# EAGLE design Electronic_Load_V1A (EAGLE 9.1.2)

## Sheet 1 of 5
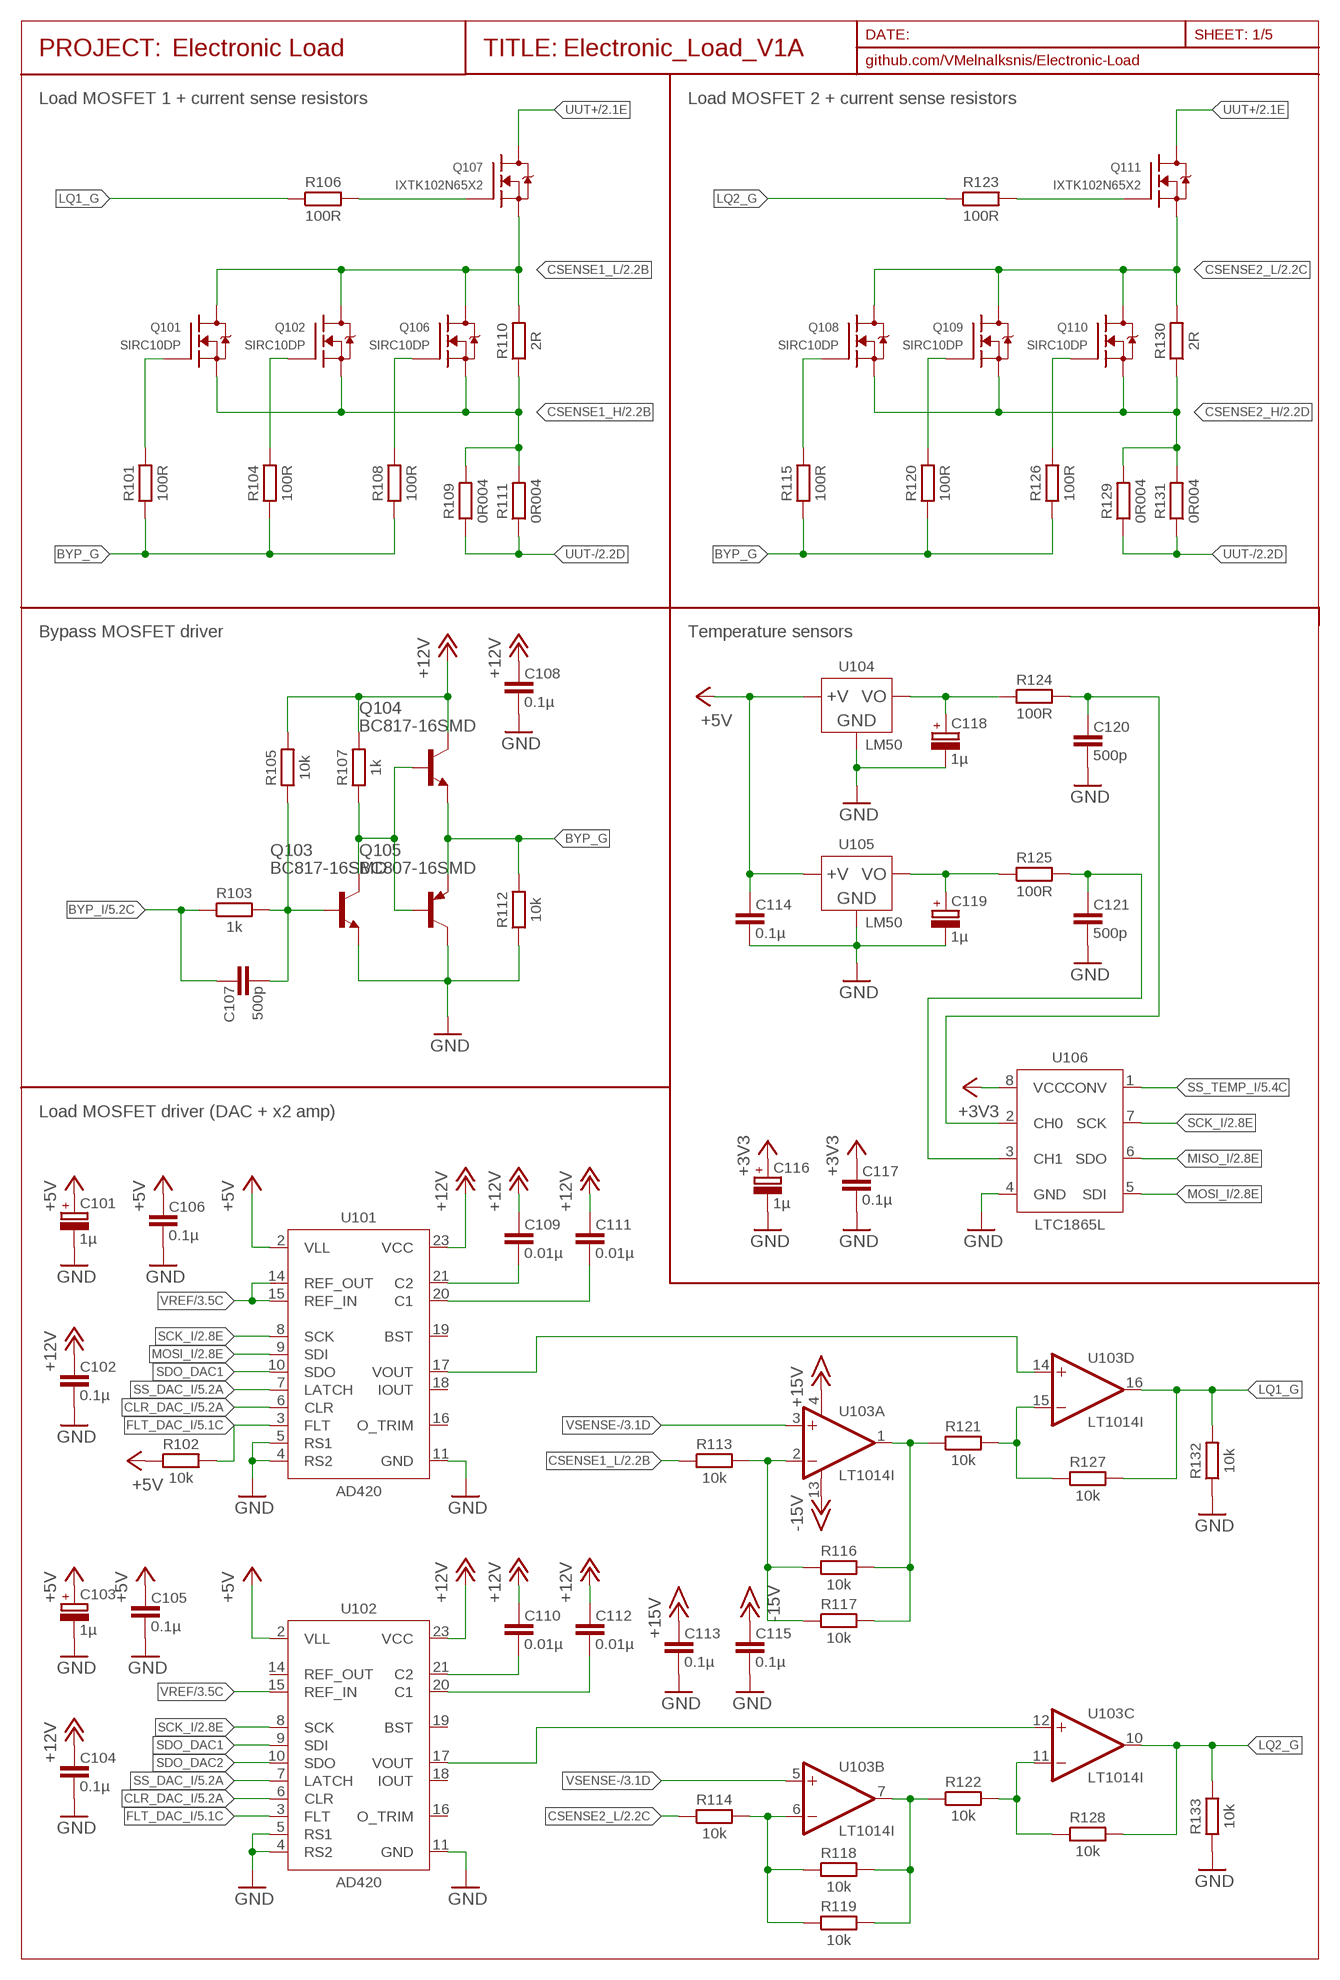
[diagram p0: schematic, sheet 1]
FRAME101 (A4-S35CP): GITHUB: github.com/VMelnalksnis/Electronic-Load; PROJECT_NAME: Electronic Load

### Parts
C101  1µ  CPOL-3216-A  [CT3216]
C102  0.1µ  C-EU-3216  [C3216]
C103  1µ  CPOL-3216-A  [CT3216]
C104  0.1µ  C-EU-3216  [C3216]
C105  0.1µ  C-EU-3216  [C3216]
C106  0.1µ  C-EU-3216  [C3216]
C107  500p  C-EU-1608  [C1608]
C108  0.1µ  C-EU-3216  [C3216]
C109  0.01µ  C-EU-3216  [C3216]
C110  0.01µ  C-EU-3216  [C3216]
C111  0.01µ  C-EU-3216  [C3216]
C112  0.01µ  C-EU-3216  [C3216]
C113  0.1µ  C-EU-3216  [C3216]
C114  0.1µ  C-EU-3216  [C3216]
C115  0.1µ  C-EU-3216  [C3216]
C116  1µ  CPOL-3216-A  [CT3216]
C117  0.1µ  C-EU-3216  [C3216]
C118  1µ  CPOL-3216-A  [CT3216]
C119  1µ  CPOL-3216-A  [CT3216]
C120  500p  C-EU-1608  [C1608]
C121  500p  C-EU-1608  [C1608]
Q101  SIRC10DP  [POWERPAK-SO-8]
Q102  SIRC10DP  [POWERPAK-SO-8]
Q103  BC817-16SMD  [SOT23-BEC]
Q104  BC817-16SMD  [SOT23-BEC]
Q105  BC807-16SMD  [SOT23-BEC]
Q106  SIRC10DP  [POWERPAK-SO-8]
Q107  IXTK102N65X2  IXTK102N65X2-NOPCB  (no package)
Q108  SIRC10DP  [POWERPAK-SO-8]
Q109  SIRC10DP  [POWERPAK-SO-8]
Q110  SIRC10DP  [POWERPAK-SO-8]
Q111  IXTK102N65X2  IXTK102N65X2-NOPCB  (no package)
R101  100R  R-EU-2012  [R2012W]
R102  10k  R-EU-1608  [R1608]
R103  1k  R-EU-1608  [R1608]
R104  100R  R-EU-2012  [R2012W]
R105  10k  R-EU-1608  [R1608]
R106  100R  R-EU-2012  [R2012W]
R107  1k  R-EU-1608  [R1608]
R108  100R  R-EU-2012  [R2012W]
R109  0R004  R-EU-6332  [R6332W]
R110  2R  R-EU-3216  [R3216W]
R111  0R004  R-EU-6332  [R6332W]
R112  10k  R-EU-1608  [R1608]
R113  10k  R-EU-1608  [R1608]
R114  10k  R-EU-1608  [R1608]
R115  100R  R-EU-2012  [R2012W]
R116  10k  R-EU-1608  [R1608]
R117  10k  R-EU-1608  [R1608]
R118  10k  R-EU-1608  [R1608]
R119  10k  R-EU-1608  [R1608]
R120  100R  R-EU-2012  [R2012W]
R121  10k  R-EU-1608  [R1608]
R122  10k  R-EU-1608  [R1608]
R123  100R  R-EU-2012  [R2012W]
R124  100R  R-EU-2012  [R2012W]
R125  100R  R-EU-2012  [R2012W]
R126  100R  R-EU-2012  [R2012W]
R127  10k  R-EU-1608  [R1608]
R128  10k  R-EU-1608  [R1608]
R129  0R004  R-EU-6332  [R6332W]
R130  2R  R-EU-3216  [R3216W]
R131  0R004  R-EU-6332  [R6332W]
R132  10k  R-EU-1608  [R1608]
R133  10k  R-EU-1608  [R1608]
U101  AD420  AD420RW-24  [SO24W]
U102  AD420  AD420RW-24  [SO24W]
U103  LT1014I  LT1014ISW  [SO16W]
U104  LM50  LM50-NOPCB  (no package)
U105  LM50  LM50-NOPCB  (no package)
U106  LTC1865L  [SO8]

### Nets
+3V3: C116.+ C117.1 U106.8(VCC) ; also sheet 2,3
+5V: C101.+ C103.+ C105.1 C106.1 C114.1 R102.1 U101.2(VLL) U102.2(VLL) U104.+V U105.+V ; also sheet 3,5
+12V: C102.1 C104.1 C108.1 C109.1 C110.1 C111.1 C112.1 Q104.C R105.2 R107.2 U101.23(VCC) U102.23(VCC) ; also sheet 3
+15V: C113.1 U103.4(A:V+) ; also sheet 2,3
-15V: C115.1 U103.13(A:V-) ; also sheet 2,3
BYP_G: Q104.E Q105.E R101.1 R104.1 R108.1 R112.2 R115.1 R120.1 R126.1
BYP_I: C107.1 R103.1 ; also sheet 5
CLR_DAC_I: U101.6(CLR) U102.6(CLR) ; also sheet 5
CSENSE1_H: Q101.1(S) Q101.2(S) Q101.3(S) Q102.1(S) Q102.2(S) Q102.3(S) Q106.1(S) Q106.2(S) Q106.3(S) R109.2 R110.1 R111.2 ; also sheet 2
CSENSE1_L: Q101.5(D) Q102.5(D) Q106.5(D) Q107.S R110.2 R113.1 ; also sheet 2,3
CSENSE2_H: Q108.1(S) Q108.2(S) Q108.3(S) Q109.1(S) Q109.2(S) Q109.3(S) Q110.1(S) Q110.2(S) Q110.3(S) R129.2 R130.1 R131.2 ; also sheet 2
CSENSE2_L: Q108.5(D) Q109.5(D) Q110.5(D) Q111.S R114.1 R130.2 ; also sheet 2,3
FLT_DAC_I: R102.2 U101.3(FLT) U102.3(FLT) ; also sheet 5
GATE1: Q107.G R106.2 ; also sheet 3
GATE2: Q111.G R123.2 ; also sheet 3
GND: C101.- C102.2 C103.- C104.2 C105.2 C106.2 C108.2 C113.2 C114.2 C115.2 C116.- C117.2 C118.- C119.- C120.2 C121.2 Q103.E Q105.C R112.1 R132.1 R133.1 U101.4(RS2) U101.5(RS1) U101.11(GND) U102.4(RS2) U102.5(RS1) U102.11(GND) U104.GND U105.GND U106.4(GND) ; also sheet 2,3,4,5
LBQ11_G: Q101.4(G) R101.2
LBQ12_G: Q102.4(G) R104.2
LBQ13_G: Q106.4(G) R108.2
LBQ21_G: Q108.4(G) R115.2
LBQ22_G: Q109.4(G) R120.2
LBQ23_G: Q110.4(G) R126.2
LQ1_G: R106.1 R127.2 R132.2 U103.16(D:OUT)
LQ2_G: R123.1 R128.2 R133.2 U103.10(C:OUT)
MISO_I: U106.6(SDO) ; also sheet 2,5
MOSI_I: U101.9(SDI) U106.5(SDI) ; also sheet 2,5
N$3: C109.2 U101.21(C2)
N$4: C111.2 U101.20(C1)
N$5: Q103.C Q104.B Q105.B R107.1
N$6: C110.2 U102.21(C2)
N$7: C112.2 U102.20(C1)
N$8: C107.2 Q103.B R103.2 R105.1
N$9: R122.2 R128.1 U103.11(C:-IN)
N$10: U101.17(VOUT) U103.14(D:+IN)
N$11: U102.17(VOUT) U103.12(C:+IN)
N$12: R121.2 R127.1 U103.15(D:-IN)
N$13: R116.2 R117.2 R121.1 U103.1(A:OUT)
N$14: R113.2 R116.1 R117.1 U103.2(A:-IN)
N$15: R114.2 R118.1 R119.1 U103.6(B:-IN)
N$16: R118.2 R119.2 R122.1 U103.7(B:OUT)
SCK_I: U101.8(SCK) U102.8(SCK) U106.7(SCK) ; also sheet 2,5
SDO_DAC1: U101.10(SDO) U102.9(SDI)
SDO_DAC2: U102.10(SDO)
SS_DAC_I: U101.7(LATCH) U102.7(LATCH) ; also sheet 5
SS_TEMP_I: U106.1(CONV) ; also sheet 5
T1_OUT: C118.+ R124.1 U104.VO ; also sheet 3
T2_OUT: C119.+ R125.1 U105.VO ; also sheet 3
TEMP1: C120.1 R124.2 U106.2(CH0)
TEMP2: C121.1 R125.2 U106.3(CH1)
UUT+ [500V]: Q107.D Q111.D ; also sheet 2
UUT-: R109.1 R111.1 R129.1 R131.1 ; also sheet 2,3
VREF: U101.14(REF_OUT) U101.15(REF_IN) U102.15(REF_IN) ; also sheet 3
VSENSE-: U103.3(A:+IN) U103.5(B:+IN) ; also sheet 2,3
Unconnected: U101.16(O_TRIM) U101.18(IOUT) U101.19(BST) U102.14(REF_OUT) U102.16(O_TRIM) U102.18(IOUT) U102.19(BST)

### Notes on the sheet
- Load MOSFET 1 + current sense resistors | Load MOSFET 2 + current sense resistors
- Bypass MOSFET driver | Temperature sensors
- Load MOSFET driver (DAC + x2 amp)

## Sheet 2 of 5
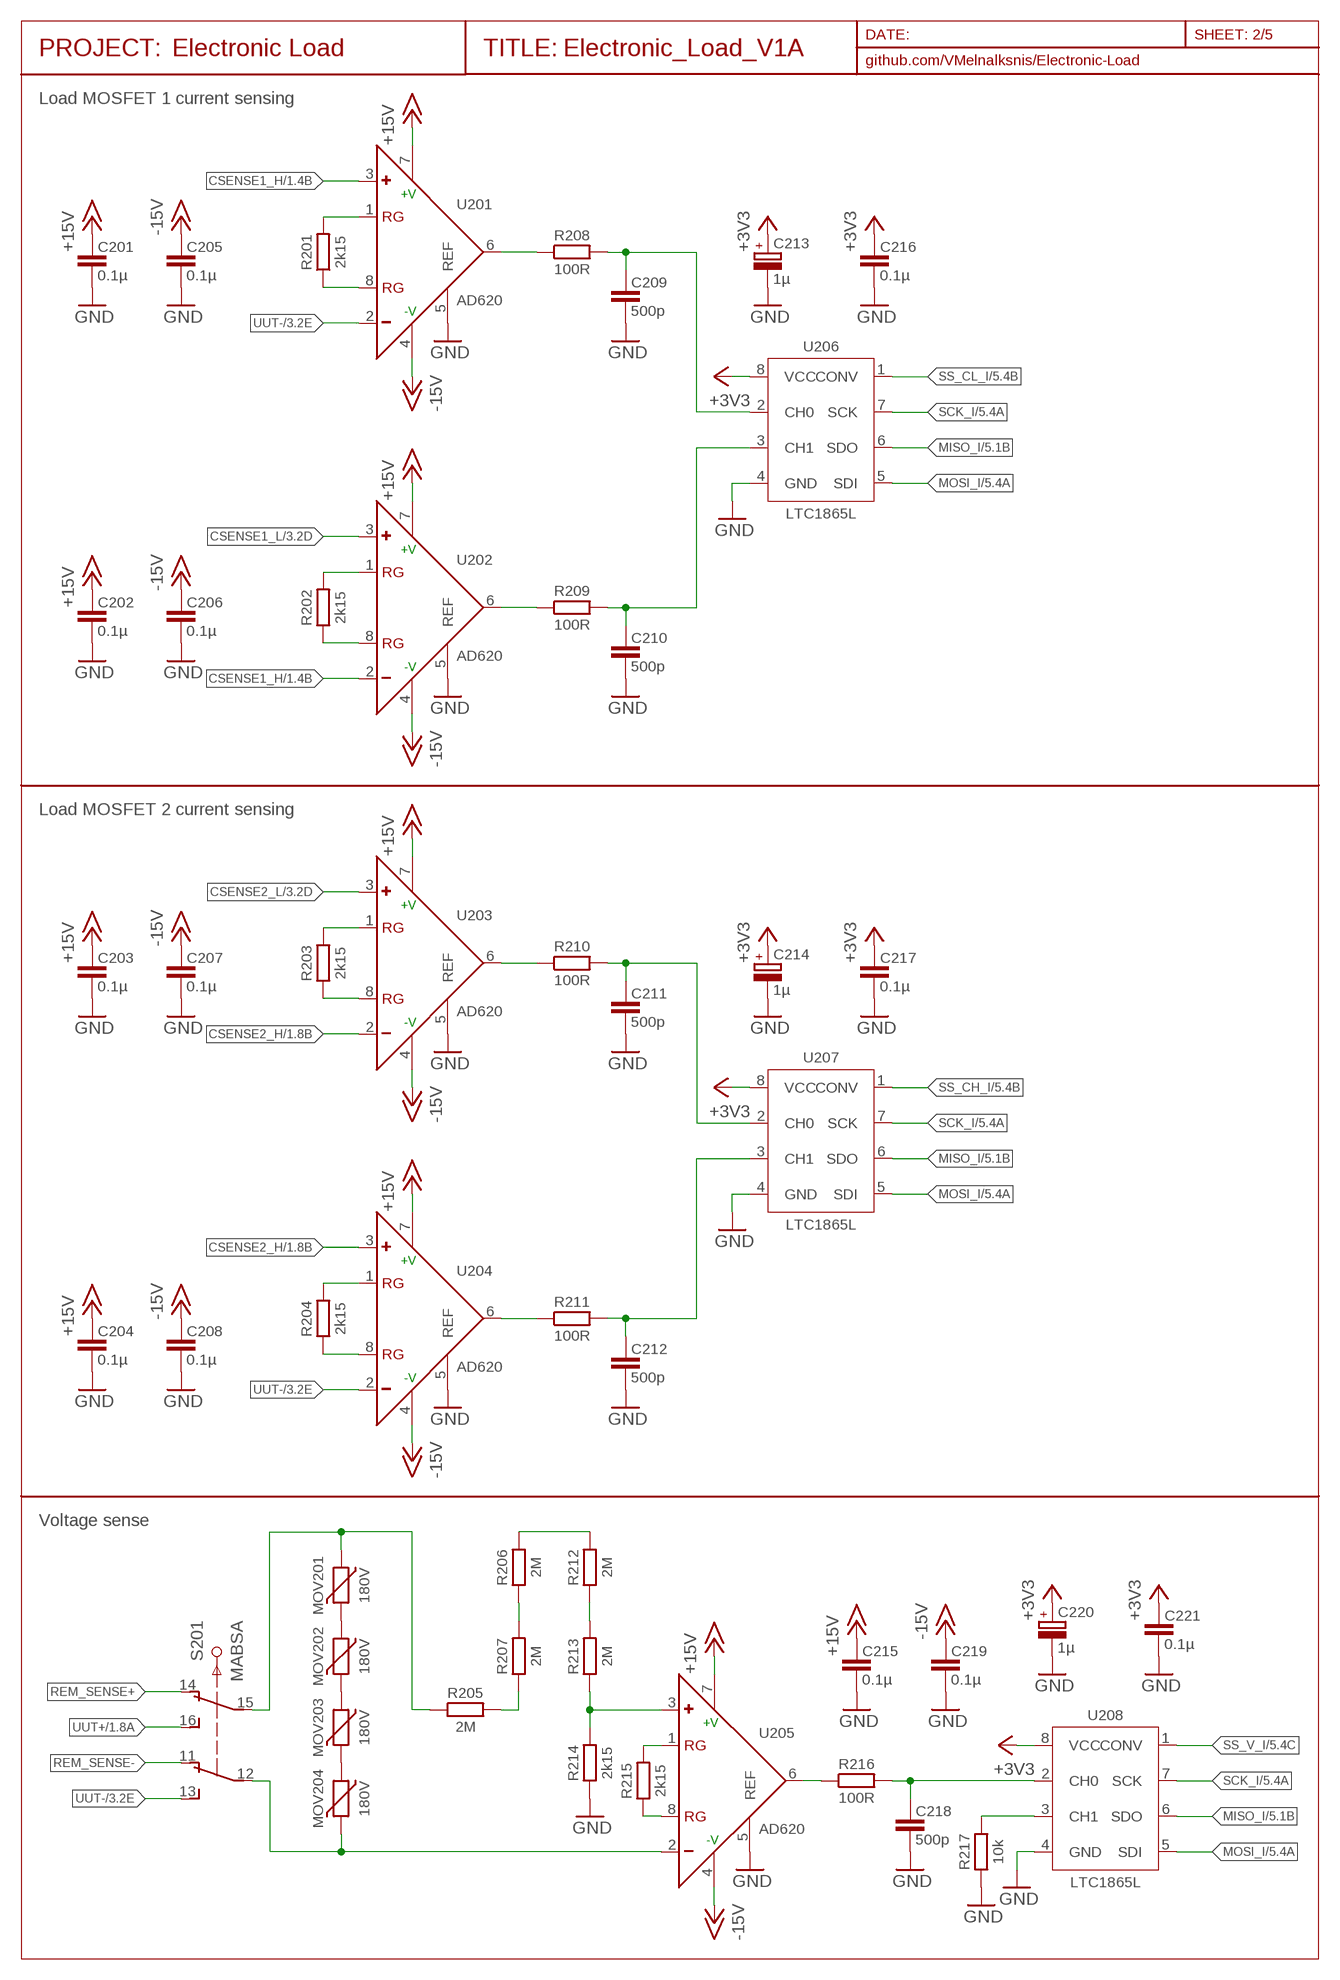
[diagram p1: schematic, sheet 2]
FRAME201 (A4-S35CP): GITHUB: github.com/VMelnalksnis/Electronic-Load; PROJECT_NAME: Electronic Load

### Parts
C201  0.1µ  C-EU-3216  [C3216]
C202  0.1µ  C-EU-3216  [C3216]
C203  0.1µ  C-EU-3216  [C3216]
C204  0.1µ  C-EU-3216  [C3216]
C205  0.1µ  C-EU-3216  [C3216]
C206  0.1µ  C-EU-3216  [C3216]
C207  0.1µ  C-EU-3216  [C3216]
C208  0.1µ  C-EU-3216  [C3216]
C209  500p  C-EU-1608  [C1608]
C210  500p  C-EU-1608  [C1608]
C211  500p  C-EU-1608  [C1608]
C212  500p  C-EU-1608  [C1608]
C213  1µ  CPOL-3216-A  [CT3216]
C214  1µ  CPOL-3216-A  [CT3216]
C215  0.1µ  C-EU-3216  [C3216]
C216  0.1µ  C-EU-3216  [C3216]
C217  0.1µ  C-EU-3216  [C3216]
C218  500p  C-EU-1608  [C1608]
C219  0.1µ  C-EU-3216  [C3216]
C220  1µ  CPOL-3216-A  [CT3216]
C221  0.1µ  C-EU-3216  [C3216]
MOV201  180V  MOV-3225  [R3225W]
MOV202  180V  MOV-3225  [R3225W]
MOV203  180V  MOV-3225  [R3225W]
MOV204  180V  MOV-3225  [R3225W]
R201  2k15  R-EU-2012  [R2012W]
R202  2k15  R-EU-2012  [R2012W]
R203  2k15  R-EU-2012  [R2012W]
R204  2k15  R-EU-2012  [R2012W]
R205  2M  R-EU-3216  [R3216W]
R206  2M  R-EU-3216  [R3216W]
R207  2M  R-EU-3216  [R3216W]
R208  100R  R-EU-2012  [R2012W]
R209  100R  R-EU-2012  [R2012W]
R210  100R  R-EU-2012  [R2012W]
R211  100R  R-EU-2012  [R2012W]
R212  2M  R-EU-3216  [R3216W]
R213  2M  R-EU-3216  [R3216W]
R214  2k15  R-EU-2012  [R2012W]
R215  2k15  R-EU-2012  [R2012W]
R216  100R  R-EU-2012  [R2012W]
R217  10k  R-EU-1608  [R1608]
S201  MABSA  [MABSA]
U201  AD620  AD620R-8  [SO8]
U202  AD620  AD620R-8  [SO8]
U203  AD620  AD620R-8  [SO8]
U204  AD620  AD620R-8  [SO8]
U205  AD620  AD620R-8  [SO8]
U206  LTC1865L  [SO8]
U207  LTC1865L  [SO8]
U208  LTC1865L  [SO8]

### Nets
+3V3: C213.+ C214.+ C216.1 C217.1 C220.+ C221.1 U206.8(VCC) U207.8(VCC) U208.8(VCC) ; also sheet 1,3
+15V: C201.1 C202.1 C203.1 C204.1 C215.1 U201.7(+V) U202.7(+V) U203.7(+V) U204.7(+V) U205.7(+V) ; also sheet 1,3
-15V: C205.1 C206.1 C207.1 C208.1 C219.1 U201.4(-V) U202.4(-V) U203.4(-V) U204.4(-V) U205.4(-V) ; also sheet 1,3
CSENSE1_H: U201.3(+) U202.2(-) ; also sheet 1
CSENSE1_L: U202.3(+) ; also sheet 1,3
CSENSE2_H: U203.2(-) U204.3(+) ; also sheet 1
CSENSE2_L: U203.3(+) ; also sheet 1,3
GND: C201.2 C202.2 C203.2 C204.2 C205.2 C206.2 C207.2 C208.2 C209.2 C210.2 C211.2 C212.2 C213.- C214.- C215.2 C216.2 C217.2 C218.2 C219.2 C220.- C221.2 R214.1 R217.1 U201.5(REF) U202.5(REF) U203.5(REF) U204.5(REF) U205.5(REF) U206.4(GND) U207.4(GND) U208.4(GND) ; also sheet 1,3,4,5
MISO_I: U206.6(SDO) U207.6(SDO) U208.6(SDO) ; also sheet 1,5
MOSI_I: U206.5(SDI) U207.5(SDI) U208.5(SDI) ; also sheet 1,5
N$1: MOV201.2 MOV202.1
N$2: MOV202.2 MOV203.1
N$17: R210.1 U203.6(OUT)
N$18: C211.1 R210.2 U207.2(CH0)
N$19: R211.1 U204.6(OUT)
N$20: C212.1 R211.2 U207.3(CH1)
N$21: C209.1 R208.2 U206.2(CH0)
N$22: C210.1 R209.2 U206.3(CH1)
N$23: R209.1 U202.6(OUT)
N$24: R208.1 U201.6(OUT)
N$25: R212.1 R213.2
N$26: R206.2 R212.2
N$27: R206.1 R207.2
N$28: R205.2 R207.1
N$29: R213.1 R214.2 U205.3(+)
N$30: C218.1 R216.2 U208.2(CH0)
N$31: R216.1 U205.6(OUT)
N$36: MOV203.2 MOV204.1
N$45: R217.2 U208.3(CH1)
REM_SENSE+: S201.14
REM_SENSE-: S201.11
RG1_H4: R203.2 U203.1(RG)
RG1_H5: R204.2 U204.1(RG)
RG1_H6: R215.2 U205.1(RG)
RG1_L3: R201.2 U201.1(RG)
RG1_L4: R202.2 U202.1(RG)
RG2_H4: R203.1 U203.8(RG)
RG2_H5: R204.1 U204.8(RG)
RG2_H6: R215.1 U205.8(RG)
RG2_L3: R201.1 U201.8(RG)
RG2_L4: R202.1 U202.8(RG)
SCK_I: U206.7(SCK) U207.7(SCK) U208.7(SCK) ; also sheet 1,5
SS_CH_I: U207.1(CONV) ; also sheet 5
SS_CL_I: U206.1(CONV) ; also sheet 5
SS_V_I: U208.1(CONV) ; also sheet 5
UUT+ [500V]: S201.16 ; also sheet 1
UUT-: S201.13 U201.2(-) U204.2(-) ; also sheet 1,3
VSENSE+: MOV201.1 R205.1 S201.15 ; also sheet 3
VSENSE-: MOV204.2 S201.12 U205.2(-) ; also sheet 1,3

### Notes on the sheet
- Load MOSFET 1 current sensing
- Load MOSFET 2 current sensing
- Voltage sense

## Sheet 3 of 5
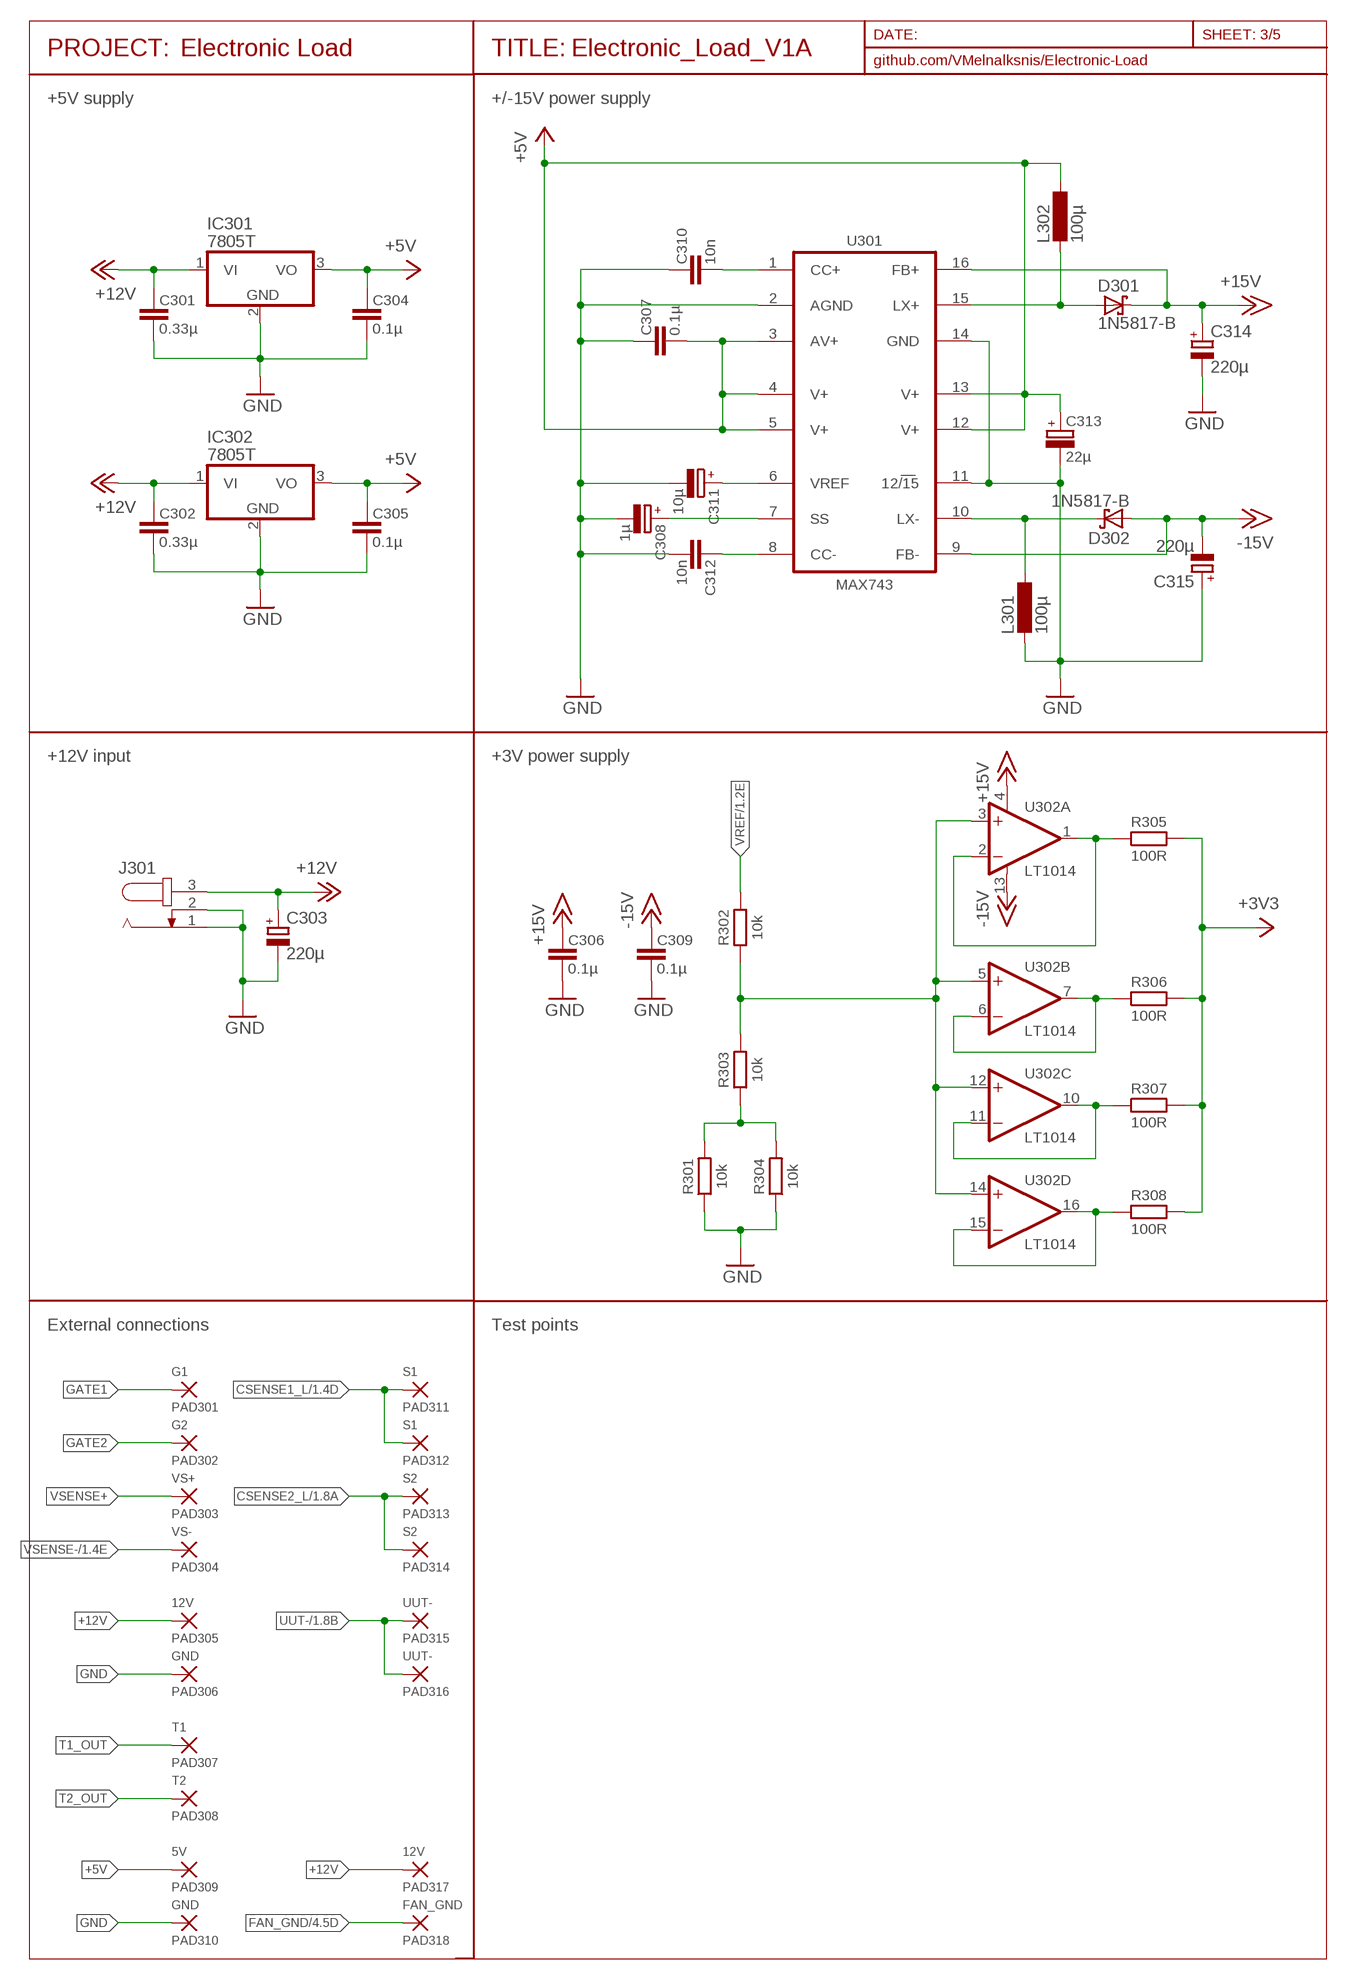
[diagram p2: schematic, sheet 3]
FRAME301 (A4-S35CP): GITHUB: github.com/VMelnalksnis/Electronic-Load; PROJECT_NAME: Electronic Load

### Parts
C301  0.33µ  C-EU-3216  [C3216]
C302  0.33µ  C-EU-3216  [C3216]
C303  220µ  CPOL-EUE3.5-10  [E3,5-10]
C304  0.1µ  C-EU-3216  [C3216]
C305  0.1µ  C-EU-3216  [C3216]
C306  0.1µ  C-EU-3216  [C3216]
C307  0.1µ  C-EU-3216  [C3216]
C308  1µ  CPOL-3216-A  [CT3216]
C309  0.1µ  C-EU-3216  [C3216]
C310  10n  C-EU-3216  [C3216]
C311  10µ  CPOL-6032-C  [CT6032]
C312  10n  C-EU-3216  [C3216]
C313  22µ  CPOL-6032-C  [CT6032]
C314  220µ  CPOL-EUE3.5-10  [E3,5-10]
C315  220µ  CPOL-EUE3.5-10  [E3,5-10]
D301  1N5817-B  [DO41-7.6]
D302  1N5817-B  [DO41-7.6]
IC301  7805T  [TO220H]
IC302  7805T  [TO220H]
J301  JACK-PLUG0  [SPC4077]
L301  100µ  L-EU0204/5  [0204/5]
L302  100µ  L-EU0204/5  [0204/5]
PAD301  G1  PAD-5X2  [PAD-5X2]
PAD302  G2  PAD-5X2  [PAD-5X2]
PAD303  VS+  PAD-5X2  [PAD-5X2]
PAD304  VS-  PAD-5X2  [PAD-5X2]
PAD305  12V  PAD-5X2  [PAD-5X2]
PAD306  GND  PAD-5X2  [PAD-5X2]
PAD307  T1  PAD-5X2  [PAD-5X2]
PAD308  T2  PAD-5X2  [PAD-5X2]
PAD309  5V  PAD-5X2  [PAD-5X2]
PAD310  GND  PAD-5X2  [PAD-5X2]
PAD311  S1  PAD-10X4  [PAD-10X4]
PAD312  S1  PAD-10X4  [PAD-10X4]
PAD313  S2  PAD-10X4  [PAD-10X4]
PAD314  S2  PAD-10X4  [PAD-10X4]
PAD315  UUT-  PAD-10X4  [PAD-10X4]
PAD316  UUT-  PAD-10X4  [PAD-10X4]
PAD317  12V  PAD-5X2  [PAD-5X2]
PAD318  FAN_GND  PAD-5X2  [PAD-5X2]
R301  10k  R-EU-1608  [R1608]
R302  10k  R-EU-1608  [R1608]
R303  10k  R-EU-1608  [R1608]
R304  10k  R-EU-1608  [R1608]
R305  100R  R-EU-2012  [R2012W]
R306  100R  R-EU-2012  [R2012W]
R307  100R  R-EU-2012  [R2012W]
R308  100R  R-EU-2012  [R2012W]
U301  MAX743  MAX743WE  [SO16W]
U302  LT1014  LT1014ISW  [SO16W]

### Nets
+3V3: R305.2 R306.2 R307.2 R308.2 ; also sheet 1,2
+5V: C304.1 C305.1 C307.2 C313.+ IC301.3(VO) IC302.3(VO) L302.1 PAD309.1(P) U301.3(AV+) U301.4(V+) U301.5(V+) U301.12(V+) U301.13(V+) ; also sheet 1,5
+12V: C301.1 C302.1 C303.+ IC301.1(VI) IC302.1(VI) J301.3 PAD305.1(P) PAD317.1(P) ; also sheet 1
+15V: C306.1 C314.+ D301.C U301.16(FB+) U302.4(A:V+) ; also sheet 1,2
-15V: C309.1 C315.- D302.A U301.9(FB-) U302.13(A:V-) ; also sheet 1,2
CSENSE1_L: PAD311.1(P) PAD312.1(P) ; also sheet 1,2
CSENSE2_L: PAD313.1(P) PAD314.1(P) ; also sheet 1,2
FAN_GND: PAD318.1(P) ; also sheet 4
GATE1: PAD301.1(P) ; also sheet 1
GATE2: PAD302.1(P) ; also sheet 1
GND: C301.2 C302.2 C303.- C304.2 C305.2 C306.2 C307.1 C308.- C309.2 C310.1 C311.- C312.2 C313.- C314.- C315.+ IC301.2(GND) IC302.2(GND) J301.1 J301.2 L301.2 PAD306.1(P) PAD310.1(P) R301.1 R304.1 U301.2(AGND) U301.11(12/15) U301.14(GND) ; also sheet 1,2,4,5
N$32: C312.1 U301.8(CC-)
N$33: C308.+ U301.7(SS)
N$34: C310.2 U301.1(CC+)
N$35: D301.A L302.2 U301.15(LX+)
N$37: R302.1 R303.2 U302.3(A:+IN) U302.5(B:+IN) U302.12(C:+IN) U302.14(D:+IN)
N$38: R306.1 U302.6(B:-IN) U302.7(B:OUT)
N$39: R305.1 U302.1(A:OUT) U302.2(A:-IN)
N$40: R307.1 U302.10(C:OUT) U302.11(C:-IN)
N$41: D302.C L301.1 U301.10(LX-)
N$43: R308.1 U302.15(D:-IN) U302.16(D:OUT)
N$79: R301.2 R303.1 R304.2
T1_OUT: PAD307.1(P) ; also sheet 1
T2_OUT: PAD308.1(P) ; also sheet 1
UUT-: PAD315.1(P) PAD316.1(P) ; also sheet 1,2
VREF: R302.2 ; also sheet 1
VREF2: C311.+ U301.6(VREF)
VSENSE+: PAD303.1(P) ; also sheet 2
VSENSE-: PAD304.1(P) ; also sheet 1,2

### Notes on the sheet
- +5V supply | +/-15V power supply
- +12V input | +3V power supply
- External connections | Test points

## Sheet 4 of 5
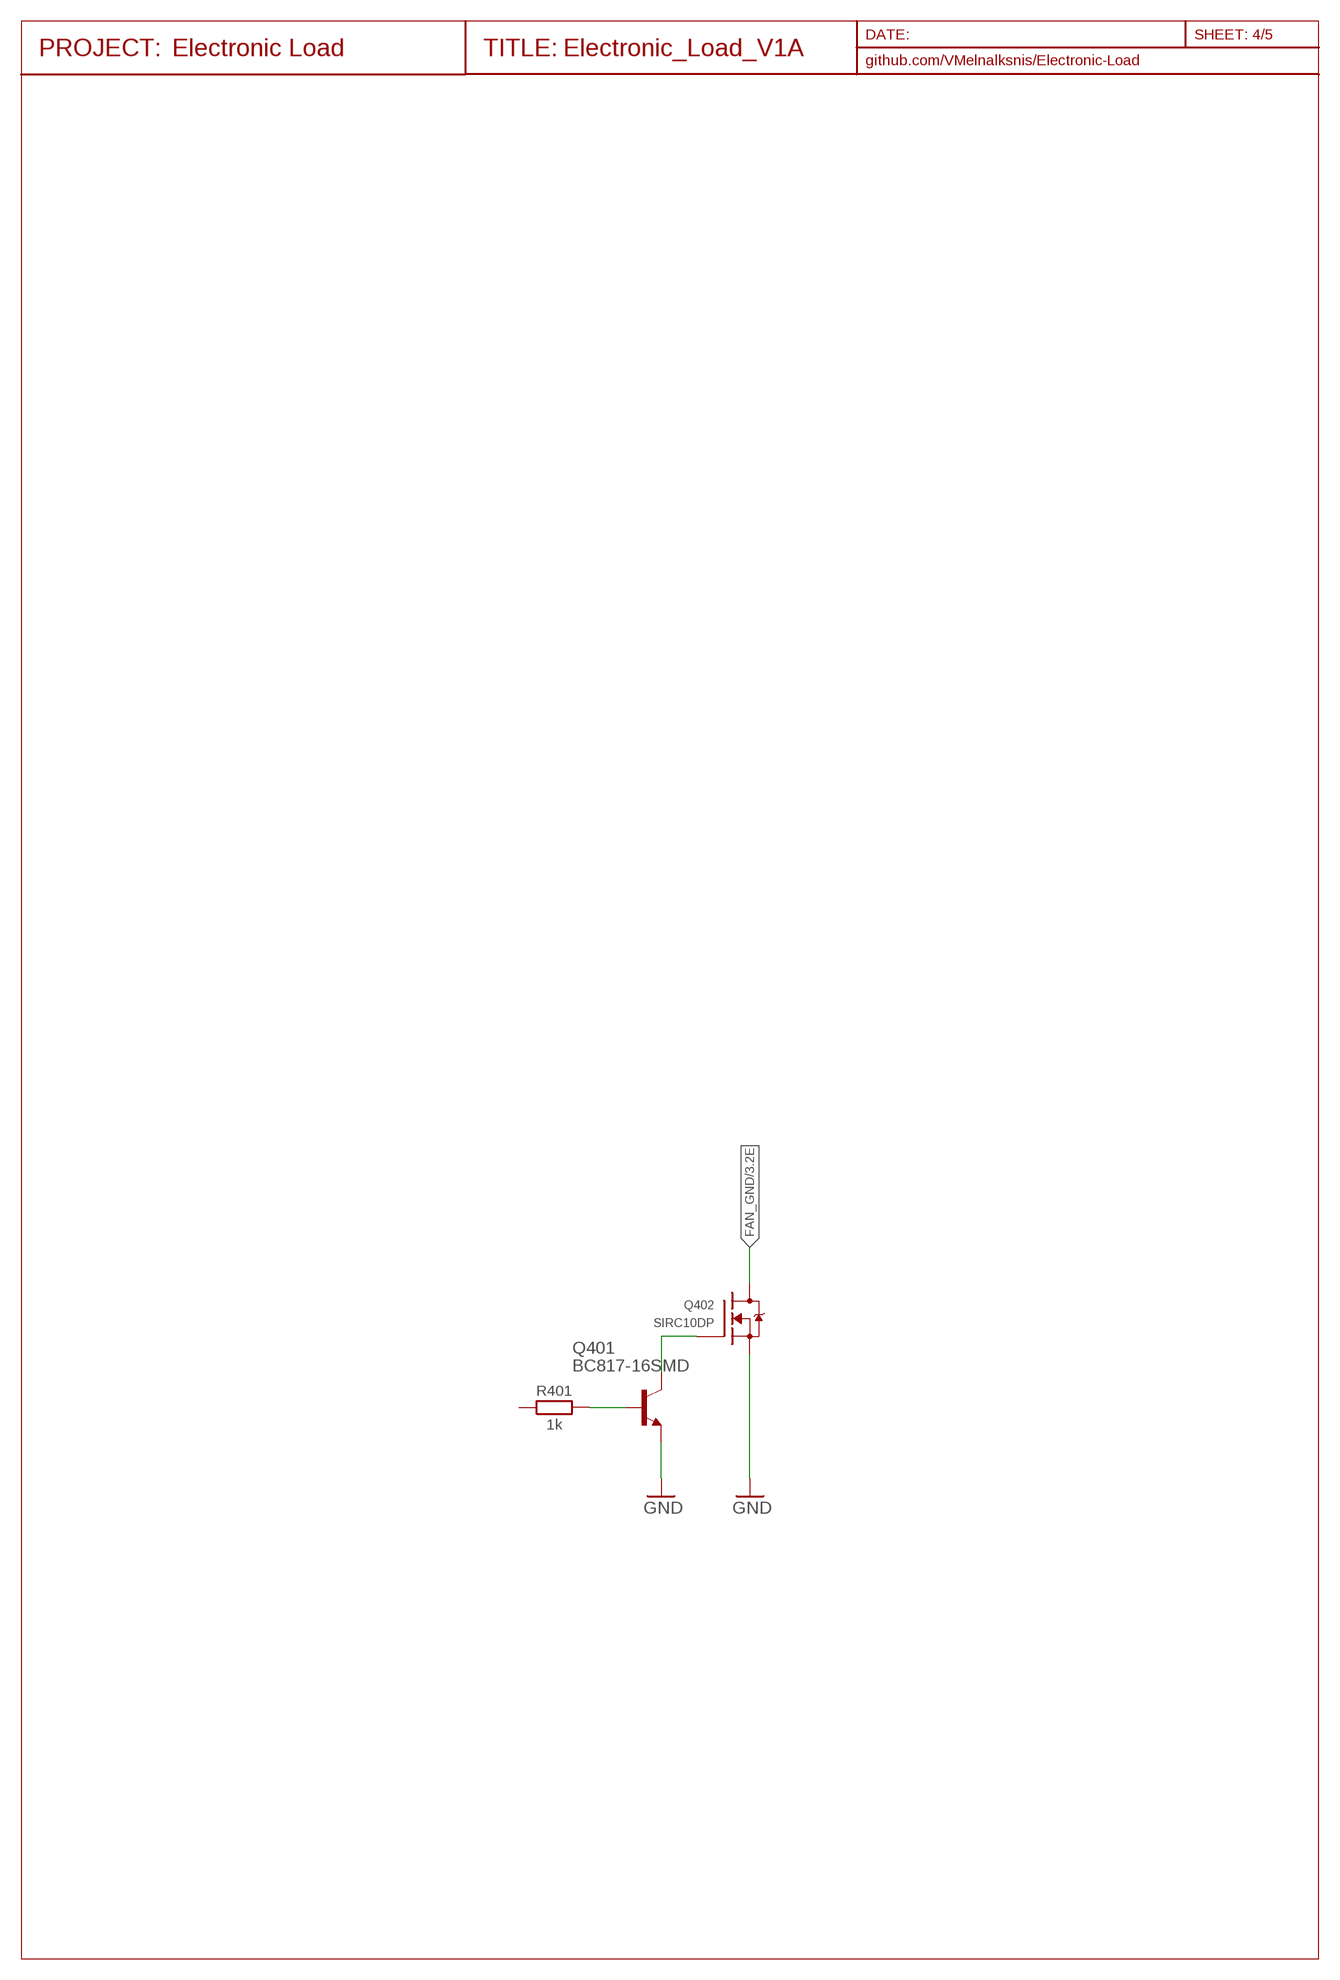
[diagram p3: schematic, sheet 4]
FRAME401 (A4-S35CP): GITHUB: github.com/VMelnalksnis/Electronic-Load; PROJECT_NAME: Electronic Load

### Parts
Q401  BC817-16SMD  [SOT23-BEC]
Q402  SIRC10DP  [POWERPAK-SO-8]
R401  1k  R-EU-1608  [R1608]

### Nets
FAN_GND: Q402.5(D) ; also sheet 3
GND: Q401.E Q402.1(S) Q402.2(S) Q402.3(S) ; also sheet 1,2,3,5
N$42: Q401.C Q402.4(G)
N$44: Q401.B R401.2
Unconnected: R401.1

## Sheet 5 of 5
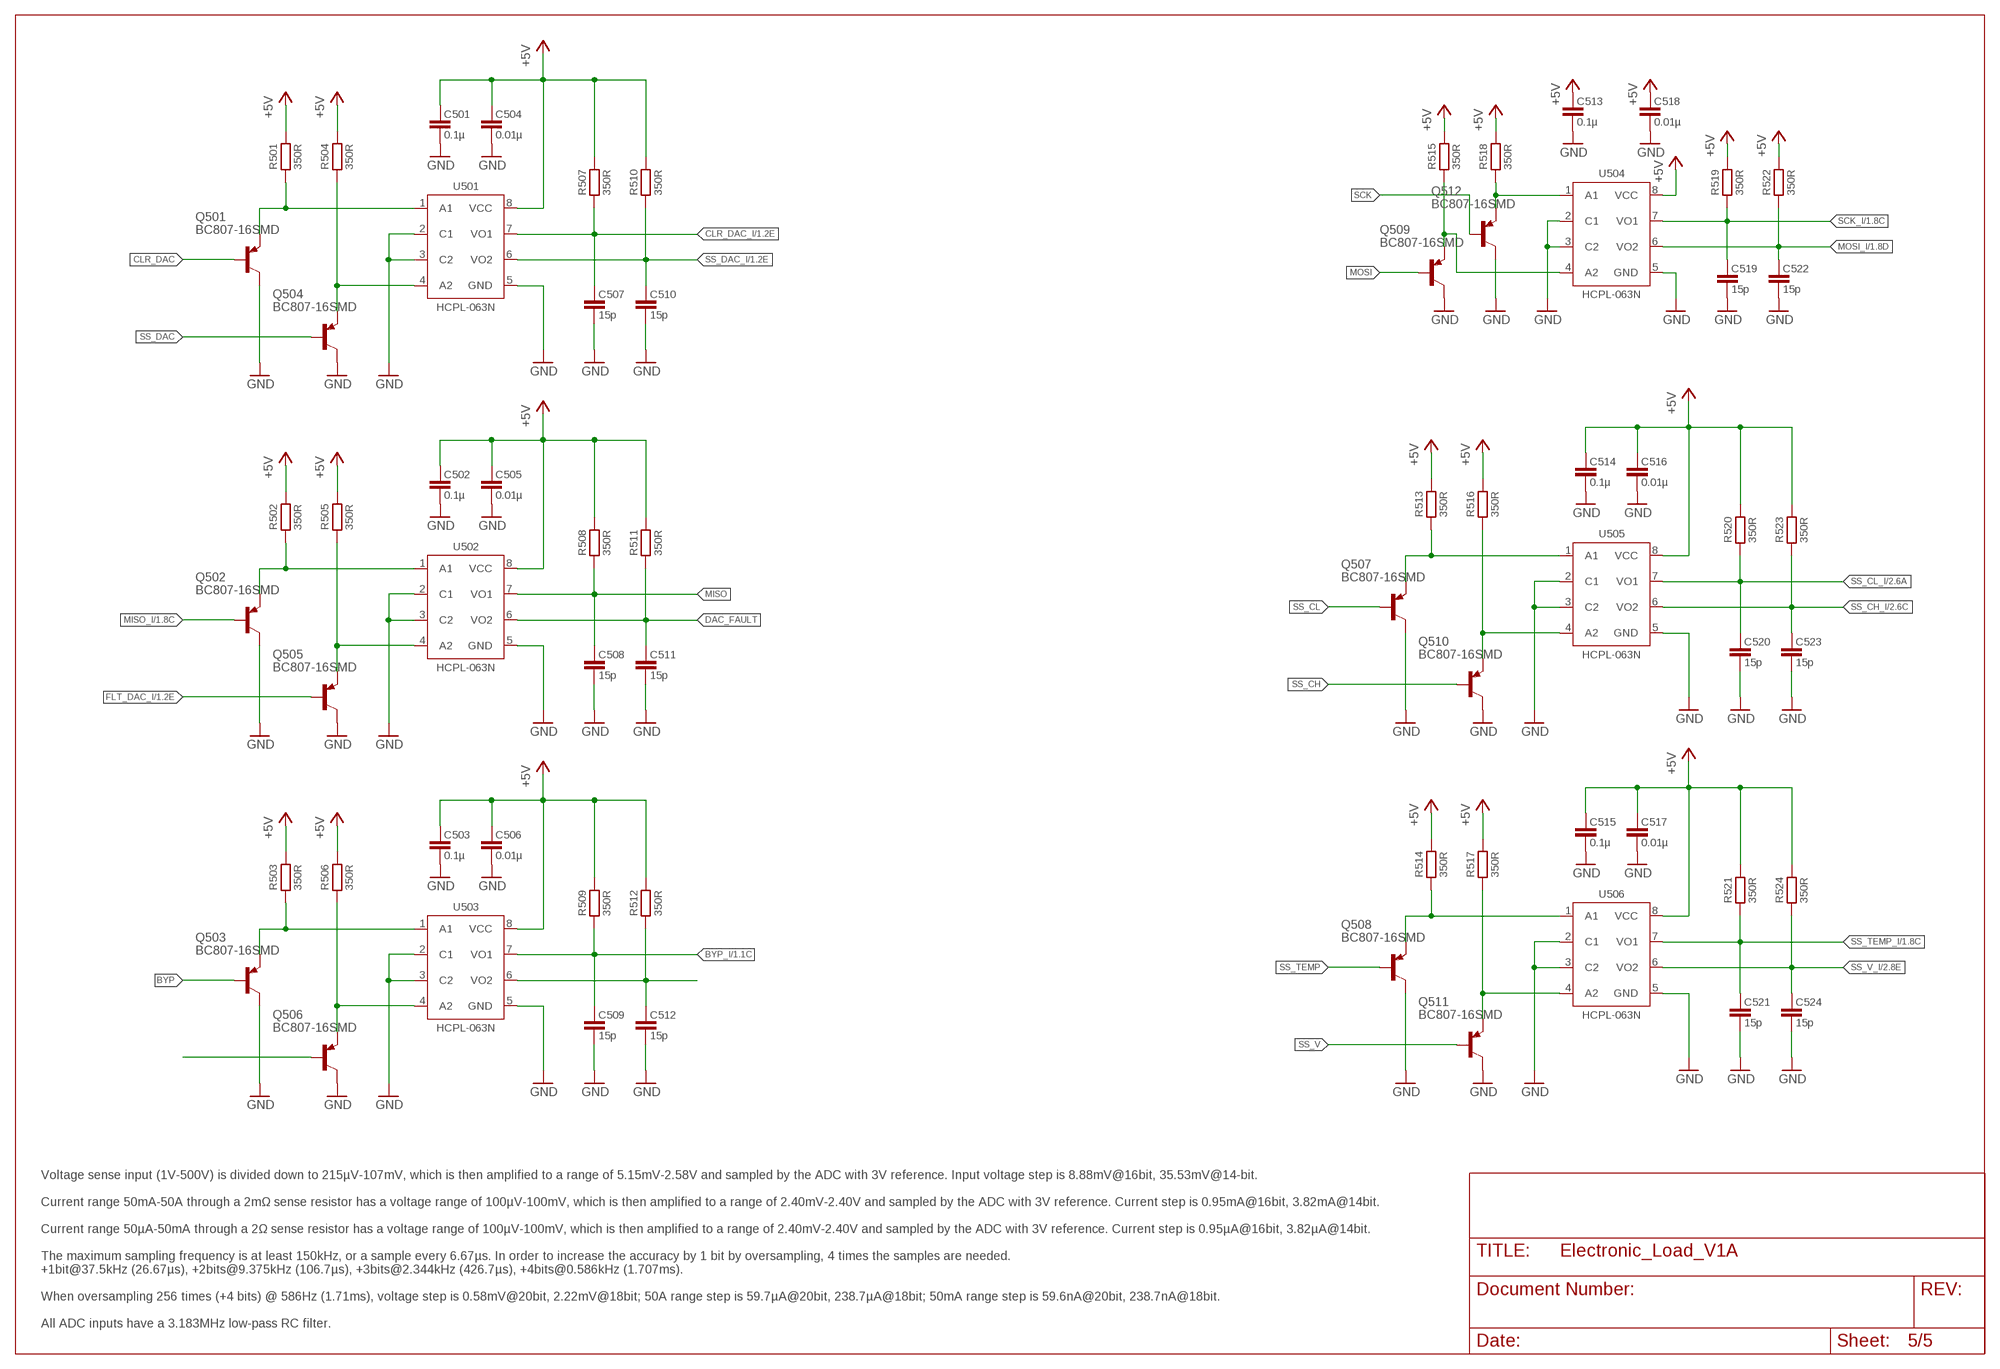
[diagram p4: schematic, sheet 5]

### Parts
C501  0.1µ  C-EU-3216  [C3216]
C502  0.1µ  C-EU-3216  [C3216]
C503  0.1µ  C-EU-3216  [C3216]
C504  0.01µ  C-EU-3216  [C3216]
C505  0.01µ  C-EU-3216  [C3216]
C506  0.01µ  C-EU-3216  [C3216]
C507  15p  C-EU-1608  [C1608]
C508  15p  C-EU-1608  [C1608]
C509  15p  C-EU-1608  [C1608]
C510  15p  C-EU-1608  [C1608]
C511  15p  C-EU-1608  [C1608]
C512  15p  C-EU-1608  [C1608]
C513  0.1µ  C-EU-3216  [C3216]
C514  0.1µ  C-EU-3216  [C3216]
C515  0.1µ  C-EU-3216  [C3216]
C516  0.01µ  C-EU-3216  [C3216]
C517  0.01µ  C-EU-3216  [C3216]
C518  0.01µ  C-EU-3216  [C3216]
C519  15p  C-EU-1608  [C1608]
C520  15p  C-EU-1608  [C1608]
C521  15p  C-EU-1608  [C1608]
C522  15p  C-EU-1608  [C1608]
C523  15p  C-EU-1608  [C1608]
C524  15p  C-EU-1608  [C1608]
Q501  BC807-16SMD  [SOT23-BEC]
Q502  BC807-16SMD  [SOT23-BEC]
Q503  BC807-16SMD  [SOT23-BEC]
Q504  BC807-16SMD  [SOT23-BEC]
Q505  BC807-16SMD  [SOT23-BEC]
Q506  BC807-16SMD  [SOT23-BEC]
Q507  BC807-16SMD  [SOT23-BEC]
Q508  BC807-16SMD  [SOT23-BEC]
Q509  BC807-16SMD  [SOT23-BEC]
Q510  BC807-16SMD  [SOT23-BEC]
Q511  BC807-16SMD  [SOT23-BEC]
Q512  BC807-16SMD  [SOT23-BEC]
R501  350R  R-EU-1608  [R1608]
R502  350R  R-EU-1608  [R1608]
R503  350R  R-EU-1608  [R1608]
R504  350R  R-EU-1608  [R1608]
R505  350R  R-EU-1608  [R1608]
R506  350R  R-EU-1608  [R1608]
R507  350R  R-EU-1608  [R1608]
R508  350R  R-EU-1608  [R1608]
R509  350R  R-EU-1608  [R1608]
R510  350R  R-EU-1608  [R1608]
R511  350R  R-EU-1608  [R1608]
R512  350R  R-EU-1608  [R1608]
R513  350R  R-EU-1608  [R1608]
R514  350R  R-EU-1608  [R1608]
R515  350R  R-EU-1608  [R1608]
R516  350R  R-EU-1608  [R1608]
R517  350R  R-EU-1608  [R1608]
R518  350R  R-EU-1608  [R1608]
R519  350R  R-EU-1608  [R1608]
R520  350R  R-EU-1608  [R1608]
R521  350R  R-EU-1608  [R1608]
R522  350R  R-EU-1608  [R1608]
R523  350R  R-EU-1608  [R1608]
R524  350R  R-EU-1608  [R1608]
U501  HCPL-063N  [SO8]
U502  HCPL-063N  [SO8]
U503  HCPL-063N  [SO8]
U504  HCPL-063N  [SO8]
U505  HCPL-063N  [SO8]
U506  HCPL-063N  [SO8]

### Nets
+5V: C501.1 C502.1 C503.1 C504.1 C505.1 C506.1 C513.1 C514.1 C515.1 C516.1 C517.1 C518.1 R501.2 R502.2 R503.2 R504.2 R505.2 R506.2 R507.2 R508.2 R509.2 R510.2 R511.2 R512.2 R513.2 R514.2 R515.2 R516.2 R517.2 R518.2 R519.2 R520.2 R521.2 R522.2 R523.2 R524.2 U501.8(VCC) U502.8(VCC) U503.8(VCC) U504.8(VCC) U505.8(VCC) U506.8(VCC) ; also sheet 1,3
BYP: Q503.B
BYP_I: C509.1 R509.1 U503.7(VO1) ; also sheet 1
CLR_DAC: Q501.B
CLR_DAC_I: C507.1 R507.1 U501.7(VO1) ; also sheet 1
DAC_FAULT: C511.1 R511.1 U502.6(VO2)
FLT_DAC_I: Q505.B ; also sheet 1
GND: C501.2 C502.2 C503.2 C504.2 C505.2 C506.2 C507.2 C508.2 C509.2 C510.2 C511.2 C512.2 C513.2 C514.2 C515.2 C516.2 C517.2 C518.2 C519.2 C520.2 C521.2 C522.2 C523.2 C524.2 Q501.C Q502.C Q503.C Q504.C Q505.C Q506.C Q507.C Q508.C Q509.C Q510.C Q511.C Q512.C U501.2(C1) U501.3(C2) U501.5(GND) U502.2(C1) U502.3(C2) U502.5(GND) U503.2(C1) U503.3(C2) U503.5(GND) U504.2(C1) U504.3(C2) U504.5(GND) U505.2(C1) U505.3(C2) U505.5(GND) U506.2(C1) U506.3(C2) U506.5(GND) ; also sheet 1,2,3,4
MISO: C508.1 R508.1 U502.7(VO1)
MISO_I: Q502.B ; also sheet 1,2
MOSI: Q509.B
MOSI_I: C522.1 R522.1 U504.6(VO2) ; also sheet 1,2
N$47: Q512.E R518.1 U504.1(A1)
N$49: Q507.E R513.1 U505.1(A1)
N$62: Q509.E R515.1 U504.4(A2)
N$63: Q510.E R516.1 U505.4(A2)
N$64: Q508.E R514.1 U506.1(A1)
N$65: Q511.E R517.1 U506.4(A2)
N$66: Q502.E R502.1 U502.1(A1)
N$67: Q505.E R505.1 U502.4(A2)
N$68: Q503.E R503.1 U503.1(A1)
N$69: Q506.E R506.1 U503.4(A2)
N$71: Q506.B
N$73: C512.1 R512.1 U503.6(VO2)
N$76: Q501.E R501.1 U501.1(A1)
N$77: Q504.E R504.1 U501.4(A2)
SCK: Q512.B
SCK_I: C519.1 R519.1 U504.7(VO1) ; also sheet 1,2
SS_CH: Q510.B
SS_CH_I: C523.1 R523.1 U505.6(VO2) ; also sheet 2
SS_CL: Q507.B
SS_CL_I: C520.1 R520.1 U505.7(VO1) ; also sheet 2
SS_DAC: Q504.B
SS_DAC_I: C510.1 R510.1 U501.6(VO2) ; also sheet 1
SS_TEMP: Q508.B
SS_TEMP_I: C521.1 R521.1 U506.7(VO1) ; also sheet 1
SS_V: Q511.B
SS_V_I: C524.1 R524.1 U506.6(VO2) ; also sheet 2

### Notes on the sheet
- Voltage sense input (1V-500V) is divided down to 215µV-107mV, which is then amplified to a range of 5.15mV-2.58V and sampled by the ADC with 3V reference. Input voltage step is 8.88mV@16bit, 35.53mV@14-bit.
  
  Current range 50mA-50A through a 2mΩ sense resistor has a voltage range of 100µV-100mV, which is then amplified to a range of 2.40mV-2.40V and sampled by the ADC with 3V reference. Current step is 0.95mA@16bit, 3.82mA@14bit.
  
  Current range 50µA-50mA through a 2Ω sense resistor has a voltage range of 100µV-100mV, which is then amplified to a range of 2.40mV-2.40V and sampled by the ADC with 3V reference. Current step is 0.95µA@16bit, 3.82µA@14bit.
  
  The maximum sampling frequency is at least 150kHz, or a sample every 6.67µs. In order to increase the accuracy by 1 bit by oversampling, 4 times the samples are needed.
  +1bit@37.5kHz (26.67µs), +2bits@9.375kHz (106.7µs), +3bits@2.344kHz (426.7µs), +4bits@0.586kHz (1.707ms).
  
  When oversampling 256 times (+4 bits) @ 586Hz (1.71ms), voltage step is 0.58mV@20bit, 2.22mV@18bit; 50A range step is 59.7µA@20bit, 238.7µA@18bit; 50mA range step is 59.6nA@20bit, 238.7nA@18bit.
  
  All ADC inputs have a 3.183MHz low-pass RC filter.

## Library data of the parts
C101 C103 C116 C118 C119 C213 C214 C220 C308 C311 C313 = passives:CPOL
C102 C104-C115 C117 C120 C121 C201-C212 C215-C219 C221 C301 C302 C304-C307 C309 C310 C312 C501-C524 = passives:C-EU
C303 C314 C315 = rcl:CPOL-EU: POLARIZED CAPACITOR, European symbol; SPICEPREFIX: C
D301 D302 = diode:1N581*: 1.0A SCHOTTKY BARRIER RECTIFIER Source: http://www.diodes.com/datasheets/ds23001.pdf
IC301 IC302 = linear:78*: Positive VOLTAGE REGULATOR Source: http://cache.national.com/ds/LM/LM78L05.pdf http://www.fairchildsemi.com/ds/LM/LM7805.pdf
J301 = con-jack:JACK-PLUG: DC POWER JACK Power Jack, DC, Right Angle, Through Hole, Rated 5A at 16VDC, PC Terminals Distributor: Farnell (www.Farnell.de) Drawing: 84N1161.pdf / 84N1162.pdf Manufacturer: SPC Technology (www.spctechnology.com) Type: SPC4077 / SPC 4078; OC_FARNELL: unknown; OC_NEWARK: unknown
L301 L302 = rcl:L-EU: INDUCTOR, European symbol; SPICEPREFIX: L
MOV201-MOV204 = passives:MOV
PAD301-PAD318 = pads:PAD
Q101 Q102 Q106 Q108-Q110 Q402 = transistors:SIRC10DP
Q103 Q104 Q401 = transistor-npn:BC817*: NPN Transistor
Q105 Q501-Q512 = transistor-pnp:BC807*: PNP Transistror
Q107 Q111 = transistors:IXTK102N65X2-NOPCB
R101-R133 R201-R217 R301-R308 R401 R501-R524 = passives:R-EU
S201 = con-hirschmann:MABSA: Dual SWITCH; OC_FARNELL: unknown; OC_NEWARK: unknown
U101 U102 = ic:AD420: The AD420 is a complete digital to current loop output converter, designed to meet the needs of the industrial control market. It provides a high precision, fully integrated, low cost single-chip solution for generating current loop signals in a compact 24-lead SOIC or PDIP package. The output current range can be programmed to 4 mA to 20 mA, 0 mA to 20 mA or to an overrange function of 0 mA to 24 mA. The AD420 can alternatively provide a voltage output from a separate pin that can be configured to provide 0 V to 5 V, 0 V to 10 V, ±5 V, or ±10 V with the addition of a single external buffer amplifier.
U103 U302 = ic:LT1014: The LT ®1014 is the first precision quad operational amplifier which directly upgrades designs in the industry standard 14-pin DIP LM324/LM348/OP-11/4156 pin configuration. It is no longer necessary to compromise specifications, while saving board space and cost, as compared to single operational amplifiers. The LT1014’s low offset voltage of 50µV, drift of 0.3µV/°C, offset current of 0.15nA, gain of 8 million, common mode rejection of 117dB and power supply rejection of 120dB qualify it as four truly precision operational amplifiers. Particularly important is the low offset voltage, since no offset null terminals are provided in the quad configuration. Although supply current is only 350µA per amplifier, a new output stage design sources and sinks in excess of 20mA of load current, while retaining high voltage gain.
U104 U105 = ic:LM50-NOPCB
U106 U206-U208 = ic:LTC1865L: The LTC®1864L/LTC1865L are 16-bit A/D converters that are offered in MSOP and SO-8 packages and operate on a single 3V supply. At 150ksps, the supply current is only 450µA. The supply current drops at lower speeds because the LTC1864L/LTC1865L automatically power down between conversions. These 16-bit switched capacitor successive approximation ADCs include sample-and-holds. The LTC1864L has a differential analog input with an external reference pin. The LTC1865L offers a softwareselectable 2-channel MUX and an external reference pin on the MSOP version. The 3-wire, serial I/O, small MSOP or SO-8 package and extremely high sample rate-to-power ratio make these ADCs ideal choices for compact, low power, high speed systems
U201-U205 = ic:AD620
U301 = ic:MAX743
U501-U506 = ic:HCPL-063N

## Net classes
0 default: width 0.203 mm, drill 0.305 mm, clearance 0.203 mm
1 500V: width 0.203 mm, drill 0.305 mm, clearance 3 mm
2 50V: width 0.203 mm, drill 0.305 mm, clearance 0.6 mm

## Board
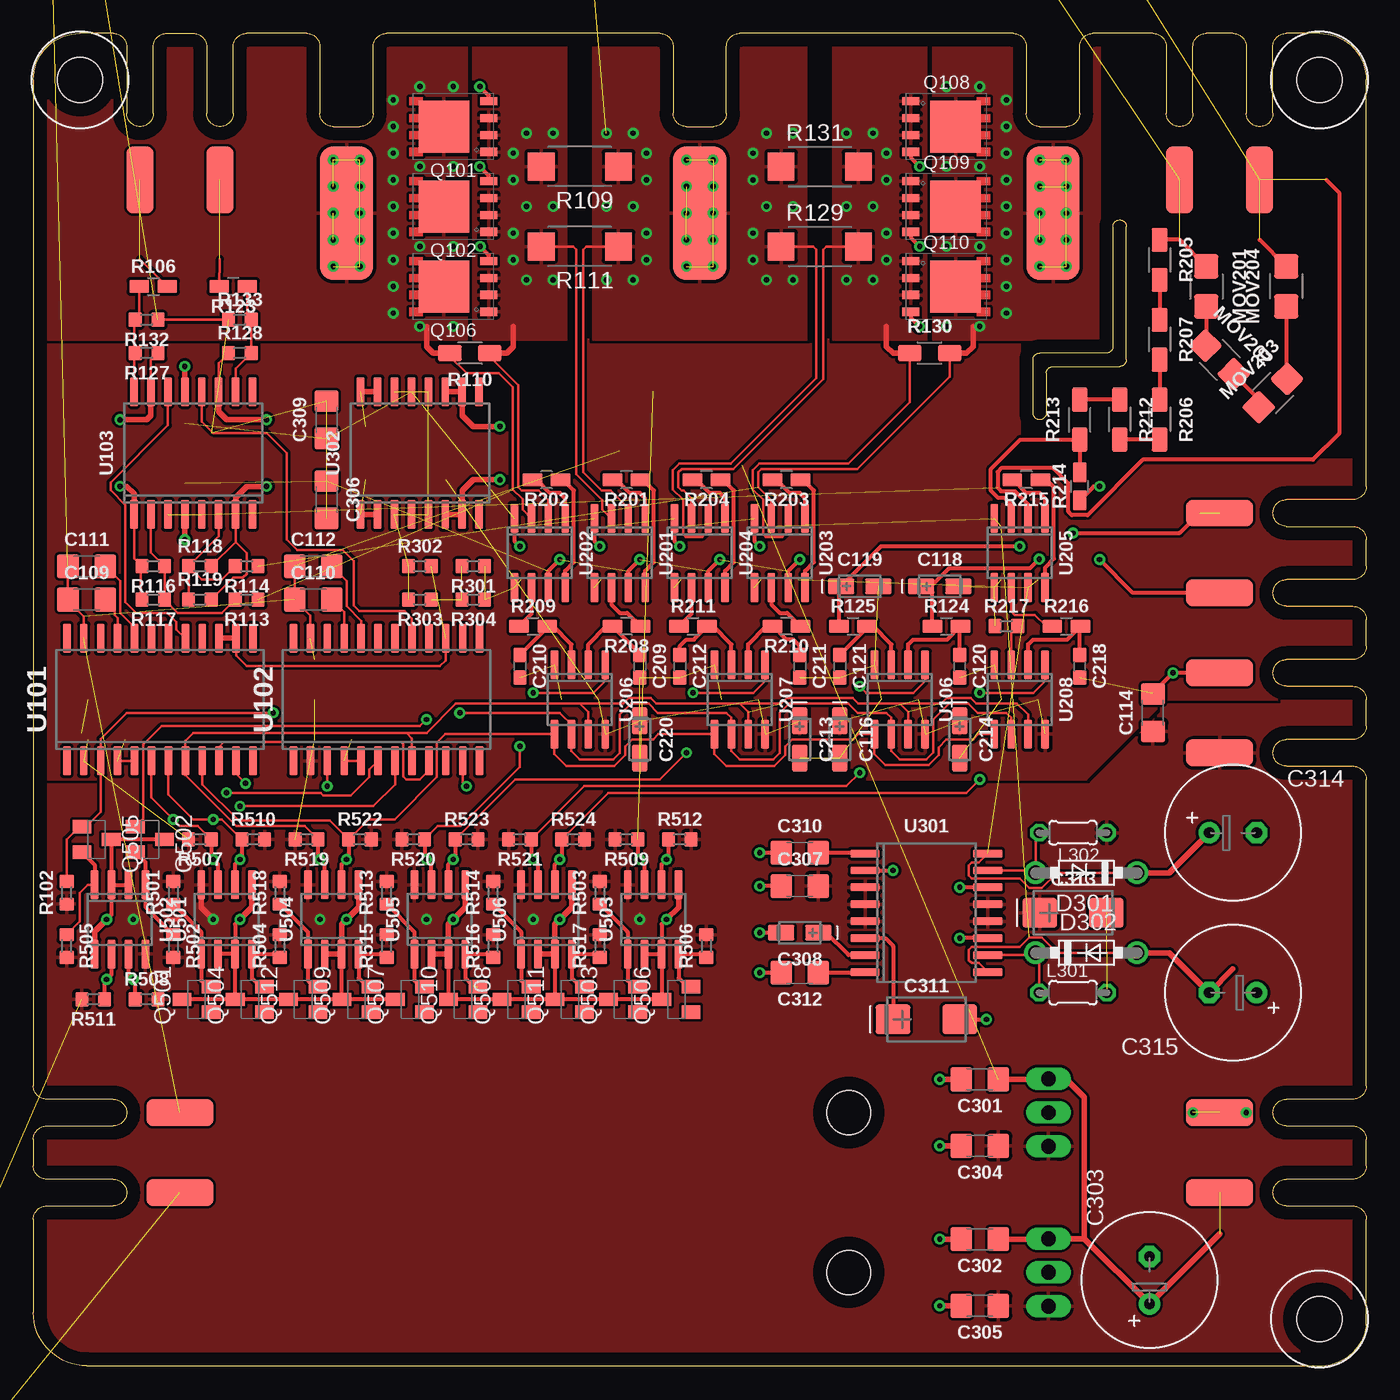
[diagram p5: board, top side]
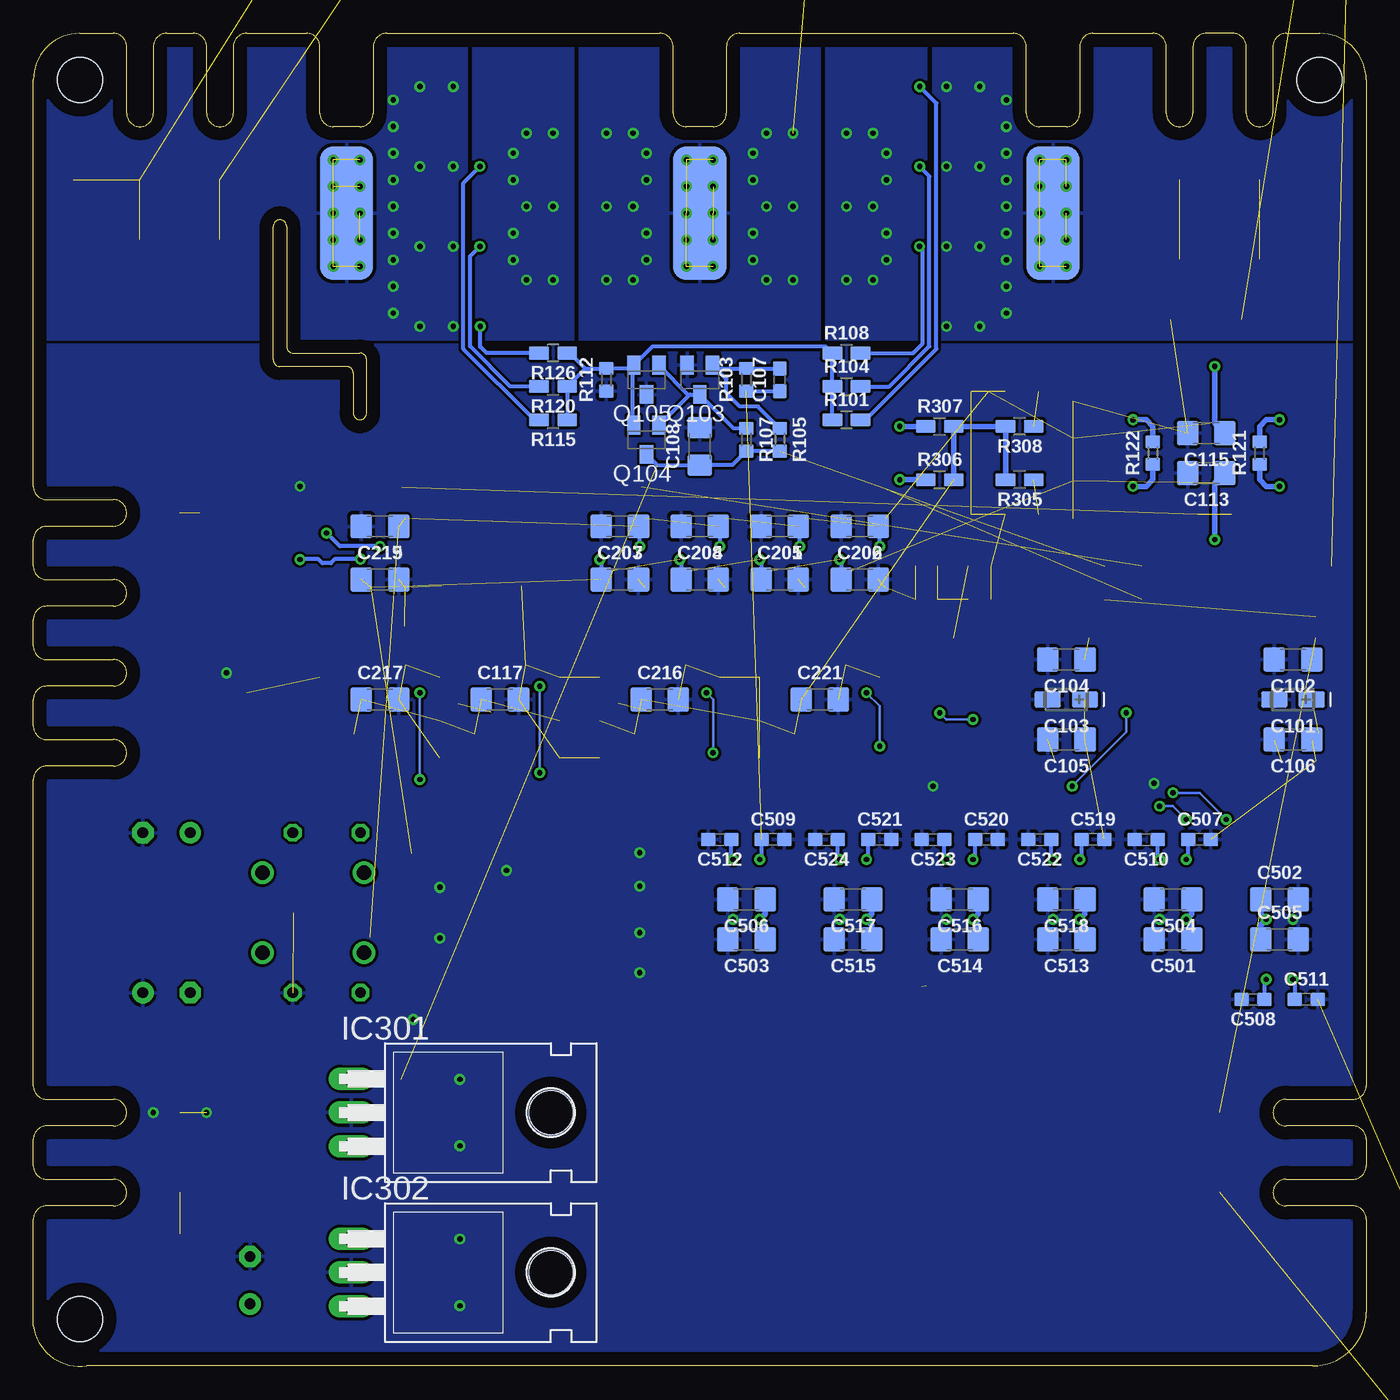
[diagram p6: board, bottom side, seen from below]

Size 100 x 100.03 mm. Coordinates in mm from the lower left corner, seen from the top.
Outline: 0,96.53 0,21.03 arc90 1,20.03 6,20.03 arc-180 6,18.03 1,18.03 arc90 0,17.03 0,15.03 arc90 1,14.03 6,14.03 arc-180 6,12.03 1,12.03 arc90 0,11.03 0,4.03 arc90 4,0.03 96,0.03 arc90 100,3.03 100,11.03 arc90 99,12.03 94,12.03 arc-180 94,14.03 99,14.03 arc90 100,15.03 100,17.03 arc90 99,18.03 94,18.03 arc-180 94,20.03 99,20.03 arc90 100,21.03 100,44.03 arc90 99,45.03 94,45.03 arc-180 94,47.03 99,47.03 arc90 100,48.03 100,50.03 arc90 99,51.03 94,51.03 arc-180 94,53.03 99,53.03 arc90 100,54.03 100,56.03 arc90 99,57.03 94,57.03 arc-180 94,59.03 99,59.03 arc90 100,60.03 100,62.03 arc90 99,63.03 94,63.03 arc-180 94,65.03 99,65.03 arc90 100,66.03 100,96.53 arc90 96.5,100.03 94,100.03 arc90 93,99.03 93,94.03 arc-180 91,94.03 91,99.03 arc90 90,100.03 88,100.03 arc90 87,99.03 87,94.03 arc-180 85,94.03 85,99.03 arc90 84,100.03 79.5,100.03 arc90 78.5,99.03 78.5,94.03 arc-90 77.5,93.03 75.5,93.03 arc-90 74.5,94.03 74.5,99.03 arc90 73.5,100.03 53,100.03 arc90 52,99.03 52,94.03 arc-90 51,93.03 49,93.03 arc-90 48,94.03 48,99.03 arc90 47,100.03 26.5,100.03 arc90 25.5,99.03 25.5,94.03 arc-90 24.5,93.03 22.5,93.03 arc-90 21.5,94.03 21.5,99.03 arc90 20.5,100.03 16,100.03 arc90 15,99.03 15,94.03 arc-180 13,94.03 13,99.03 arc90 12,100.03 10,100.03 arc90 9,99.03 9,94.03 arc-180 7,94.03 7,99.03 arc90 6,100.03 3.5,100.03 arc90 0,96.53
Outline: 76.5,75.03 81.5,75.03 arc90 82,75.53 82,85.53 arc180 81,85.53 81,76.53 arc-90 80.5,76.03 75.5,76.03 arc90 75,75.53 75,71.53 arc180 76,71.53 76,74.53 arc-90 76.5,75.03
Copper layers (1*16): Top 0.035mm / dielectric 1.5mm / Bottom 0.035mm
Design rules "default": minimum track width 6mil, minimum drill 0.35mm, track to track 6mil, track to pad 6mil, pad to pad 6mil, via to via 6mil, smd to smd 6mil, copper to edge 40mil, drill to drill 6mil, minimum pad ring 10mil, minimum via ring 8mil, stop-mask expansion 4mil, vias tented up to drill 0mil, thermal gap 10mil

### Footprints (pad centres in the part's own frame; a part is rotated, then mirrored left to right if it is on the bottom)
CT3216 = smd 2 x 1.2: + -1.4,0; - 1.4,0
C3216 = smd 1.6 x 1.8: 1 -1.4,0; 2 1.4,0
C1608 = smd 1.1 x 1: 1 -0.85,0; 2 0.85,0
E3,5-10 = drill 0.813 pad 1.6: + -1.778,0 | drill 0.813 pad 1.6 octagon: - 1.778,0
CT6032 = smd 2.6 x 2.2: + -2.5,0; - 2.5,0
DO41-7.6 = drill 1.1 pad 1.7: A 3.81,0; C -3.81,0
TO220H = drill 1.118 long: 1 -2.54,-10.16; 2 0,-10.16; 3 2.54,-10.16 | hole 3.302: 0,4.826
SPC4077 = drill 0.8 pad 2.184 long: 1 -3,0; 2 0,-4.8 | drill 1 pad 2.184 long: 3 3,0
0204/5 = drill 0.813 octagon: 1 -2.54,0; 2 2.54,0
R3225W = smd 1.8 x 1.8: 1 -1.499,0; 2 1.499,0
PAD-5X2 = smd 5 x 2: 1 0,0
PAD-10X4 = smd 10 x 4: 1 0,0
POWERPAK-SO-8 = smd 1.27 x 0.61: 1 -2.67,1.905; 2 -2.67,0.635; 3 -2.67,-0.635; 4 -2.67,-1.905 | smd 3.81 x 3.91: 5 0.69,0
SOT23-BEC = smd 1 x 1.4: B -0.95,-1.1; C 0,1.1; E 0.95,-1.1
R2012W = smd 1.5 x 1: 1 -1.052,0; 2 1.052,0
R1608 = smd 1 x 1.1: 1 -0.85,0; 2 0.85,0
R6332W = smd 2 x 2.1: 1 -2.896,0; 2 2.896,0
R3216W = smd 1.8 x 1.2: 1 -1.499,0; 2 1.499,0
MABSA = drill 1.321 long: 11 5.08,-5.08; 12 5.08,0; 13 5.08,5.08; 14 -5.08,-5.08; 15 -5.08,0; 16 -5.08,5.08 | hole 2.794: 0,-5.08
SO24W = smd 0.6 x 2.2: 1 -6.985,-4.6; 2 -5.715,-4.6; 3 -4.445,-4.6; 4 -3.175,-4.6; 5 -1.905,-4.6; 6 -0.635,-4.6; 7 0.635,-4.6; 8 1.905,-4.6; 9 3.175,-4.6; 10 4.445,-4.6; 11 5.715,-4.6; 12 6.985,-4.6; 13 6.985,4.6; 14 5.715,4.6; 15 4.445,4.6; 16 3.175,4.6; 17 1.905,4.6; 18 0.635,4.6; 19 -0.635,4.6; 20 -1.905,4.6; 21 -3.175,4.6; 22 -4.445,4.6; 23 -5.715,4.6; 24 -6.985,4.6
SO16W = smd 0.6 x 2.2: 1 -4.445,-4.6; 2 -3.175,-4.6; 3 -1.905,-4.6; 4 -0.635,-4.6; 5 0.635,-4.6; 6 1.905,-4.6; 7 3.175,-4.6; 8 4.445,-4.6; 9 4.445,4.6; 10 3.175,4.6; 11 1.905,4.6; 12 0.635,4.6; 13 -0.635,4.6; 14 -1.905,4.6; 15 -3.175,4.6; 16 -4.445,4.6
SO8 = smd 0.6 x 2.2: 1 -1.905,-2.6; 2 -0.635,-2.6; 3 0.635,-2.6; 4 1.905,-2.6; 5 1.905,2.6; 6 0.635,2.6; 7 -0.635,2.6; 8 -1.905,2.6
M3 = hole 3.4: 0,0

### Placement (x,y rotation side)
C101  5.5,50.03 180 bottom
C102  5.5,53.03 180 bottom
C103  22.5,50.03 180 bottom
C104  22.5,53.03 180 bottom
C105  22.5,47.03 180 bottom
C106  5.5,47.03 180 bottom
C107  44,74.03 90 bottom
C108  50,69.03 90 bottom
C109  4,57.53 0 top
C110  21,57.53 0 top
C111  4,60.03 0 top
C112  21,60.03 0 top
C113  12,67.03 180 bottom
C114  84,49.03 90 top
C115  12,70.03 180 bottom
C116  60.5,47.03 270 top
C117  65,50.03 0 bottom
C118  68,58.53 0 top
C119  62,58.53 0 top
C120  69.5,52.53 270 top
C121  60.5,52.53 270 top
C201  44,59.03 0 bottom
C202  38,59.03 0 bottom
C203  56,59.03 0 bottom
C204  50,59.03 0 bottom
C205  44,63.03 180 bottom
C206  38,63.03 180 bottom
C207  56,63.03 180 bottom
C208  50,63.03 180 bottom
C209  45.5,52.53 270 top
C210  36.5,52.53 270 top
C211  57.5,52.53 270 top
C212  48.5,52.53 270 top
C213  57.5,47.03 270 top
C214  69.5,47.03 270 top
C215  74,59.03 0 bottom
C216  53,50.03 0 bottom
C217  74,50.03 0 bottom
C218  78.5,52.53 270 top
C219  74,63.03 180 bottom
C220  45.5,47.03 270 top
C221  41,50.03 0 bottom
C301  71,21.53 180 top
C302  71,9.53 180 top
C303  83.74,6.45 90 top
C304  71,16.53 180 top
C305  71,4.53 180 top
C306  22,65.03 270 top
C307  57.5,36.03 0 top
C308  57.5,32.53 180 top
C309  22,71.03 90 top
C310  57.5,38.53 0 top
C311  67,26.03 0 top
C312  57.5,29.53 180 top
C313  78,34.03 0 top
C314  90,40.03 0 top
C315  90,28.03 180 top
C501  14.5,32.03 180 bottom
C502  6.5,35.03 0 bottom
C503  46.5,32.03 180 bottom
C504  14.5,35.03 180 bottom
C505  6.5,32.03 0 bottom
C506  46.5,35.03 180 bottom
C507  12.5,39.53 0 bottom
C508  8.5,27.53 180 bottom
C509  44.5,39.53 0 bottom
C510  16.5,39.53 180 bottom
C511  4.5,27.53 0 bottom
C512  48.5,39.53 180 bottom
C513  22.5,32.03 180 bottom
C514  30.5,32.03 180 bottom
C515  38.5,32.03 180 bottom
C516  30.5,35.03 180 bottom
C517  38.5,35.03 180 bottom
C518  22.5,35.03 180 bottom
C519  20.5,39.53 0 bottom
C520  28.5,39.53 0 bottom
C521  36.5,39.53 0 bottom
C522  24.5,39.53 180 bottom
C523  32.5,39.53 180 bottom
C524  40.5,39.53 180 bottom
D301  79,37.03 180 top
D302  79,31.03 0 top
IC301  66,19.03 270 bottom
IC302  66,7.03 270 bottom
J301  0,165.03 270 top  (outside the outline)
L301  78,28.03 0 top
L302  78,40.03 180 top
MOV201  88,81.03 270 top
MOV202  89,75.53 315 top
MOV203  93,73.03 45 top
MOV204  94,81.03 90 top
PAD301  8,89.03 90 top
PAD302  14,89.03 90 top
PAD303  86,89.03 90 top
PAD304  92,89.03 90 top
PAD305  89,13.03 0 top
PAD306  89,19.03 0 top
PAD307  89,58.03 0 top
PAD308  89,64.03 0 top
PAD309  89,46.03 0 top
PAD310  89,52.03 0 top
PAD311  23.5,86.53 90 top
PAD312  23.5,86.53 90 bottom
PAD313  76.5,86.53 90 top
PAD314  76.5,86.53 270 bottom
PAD315  50,86.53 90 top
PAD316  50,86.53 90 bottom
PAD317  11,19.03 0 top
PAD318  11,13.03 0 top
Q101  31.5,93.03 180 top
Q102  31.5,87.03 180 top
Q103  50,74.03 180 bottom
Q104  54,69.53 180 bottom
Q105  54,74.03 180 bottom
Q106  31.5,81.03 180 top
Q108  68.5,93.03 0 top
Q109  68.5,87.03 0 top
Q110  68.5,81.03 0 top
Q401  -13,-22.97 0 top  (outside the outline)
Q402  -10,-11.97 0 top  (outside the outline)
Q501  12.25,27.53 90 top
Q502  8.75,39.53 270 top
Q503  44.25,27.53 90 top
Q504  16.25,27.53 90 top
Q505  4.75,39.53 270 top
Q506  48.25,27.53 90 top
Q507  28.25,27.53 90 top
Q508  36.25,27.53 90 top
Q509  24.25,27.53 90 top
Q510  32.25,27.53 90 top
Q511  40.25,27.53 90 top
Q512  20.25,27.53 90 top
R101  39,71.03 0 bottom
R102  2.5,35.53 90 top
R103  46.5,74.03 90 bottom
R104  39,73.53 0 bottom
R105  44,69.53 270 bottom
R106  9,81.03 0 top
R107  46.5,69.53 270 bottom
R108  39,76.03 0 bottom
R109  41,90.03 180 top
R110  32.75,76.03 180 top
R111  41,84.03 180 top
R112  57,74.03 90 bottom
R113  16,57.53 180 top
R114  16,60.03 180 top
R115  61,71.03 180 bottom
R116  9,60.03 180 top
R117  9,57.53 180 top
R118  12.5,60.03 0 top
R119  12.5,57.53 0 top
R120  61,73.53 180 bottom
R121  8,68.53 90 bottom
R122  16,68.53 90 bottom
R123  15,81.03 180 top
R124  68.5,55.53 0 top
R125  61.5,55.53 0 top
R126  61,76.03 180 bottom
R127  8.5,76.03 180 top
R128  15.5,76.03 0 top
R129  59,84.03 0 top
R130  67.25,76.03 0 top
R131  59,90.03 0 top
R132  8.5,78.53 180 top
R133  15.5,78.53 0 top
R201  44.5,66.53 180 top
R202  38.5,66.53 180 top
R203  56.5,66.53 180 top
R204  50.5,66.53 180 top
R205  84.5,83.03 270 top
R206  84.5,71.03 270 top
R207  84.5,77.03 270 top
R208  44.5,55.53 180 top
R209  37.5,55.53 0 top
R210  56.5,55.53 180 top
R211  49.5,55.53 0 top
R212  81.5,71.03 270 top
R213  78.5,71.03 90 top
R214  78.5,66.03 90 top
R215  74.5,66.53 180 top
R216  77.5,55.53 0 top
R217  73,55.53 0 top
R301  33,60.03 180 top
R302  29,60.03 0 top
R303  29,57.53 180 top
R304  33,57.53 180 top
R305  26,66.53 180 bottom
R306  32,66.53 0 bottom
R307  32,70.53 0 bottom
R308  26,70.53 180 bottom
R401  -14,-29.97 0 top  (outside the outline)
R501  10.5,35.53 90 top
R502  10.5,31.53 270 top
R503  42.5,35.53 90 top
R504  18.5,31.53 90 top
R505  2.5,31.53 270 top
R506  50.5,31.53 90 top
R507  12.5,39.53 180 top
R508  8.5,27.53 0 top
R509  44.5,39.53 180 top
R510  16.5,39.53 0 top
R511  4.5,27.53 180 top
R512  48.5,39.53 0 top
R513  26.5,35.53 90 top
R514  34.5,35.53 90 top
R515  26.5,31.53 90 top
R516  34.5,31.53 90 top
R517  42.5,31.53 90 top
R518  18.5,35.53 90 top
R519  20.5,39.53 180 top
R520  28.5,39.53 180 top
R521  36.5,39.53 180 top
R522  24.5,39.53 0 top
R523  32.5,39.53 0 top
R524  40.5,39.53 0 top
S201  30,180.03 0 top  (outside the outline)
U101  9.5,50.03 0 top
U102  26.5,50.03 0 top
U103  12,68.53 0 top
U106  65,50.03 180 top
U201  44,61.03 180 top
U202  38,61.03 180 top
U203  56,61.03 180 top
U204  50,61.03 180 top
U205  74,61.03 180 top
U206  41,50.03 180 top
U207  53,50.03 180 top
U208  74,50.03 180 top
U301  67,34.03 270 top
U302  29,68.53 0 top
U501  14.5,33.53 0 top
U502  6.5,33.53 180 top
U503  46.5,33.53 0 top
U504  22.5,33.53 0 top
U505  30.5,33.53 0 top
U506  38.5,33.53 0 top
U$1  [M3]  3.5,96.53 0 top
U$2  [M3]  96.5,96.53 0 top
U$5  [M3]  96.5,3.53 0 top

### Tracks (layer width: path | path; a pad name or v marks a point on that pad's centre or on a via)
+3V3  (11 unrouted)
  Bottom 0.406: R305.2 R308.2 R307.2 R306.2
  pour Top (rank 2): -1,77.03 74,77.03 74,68.03 101,68.03 101,50.03 85,50.03 79,44.03 -1,44.03
+5V  (via drill 0.4)  (6 unrouted)
  Top 0.203: v45.5,33.53 45.5,33.94
  Top 0.305: R503.2 42.75,36.13 | R502.2 10.25,30.93 | 10.15,33.53 10.85,33.53
  Top 0.406: U501.8 12.6,34.44 v13.5,33.53
  Bottom 0.406: 3.6,47.53 C106.1 | C517.1 37.1,33.93 v37.5,33.53 37.1,33.13 C515.1 | C516.1 29.1,33.93 v29.5,33.53 29.1,33.13 C514.1 | C518.1 21.1,33.93 v21.5,33.53 21.1,33.13 C513.1 | C505.1 7.9,33.13 v7.5,33.53 7.9,33.93 C502.1 | C504.1 13.1,33.93 v13.5,33.53 13.1,33.13 C501.1 | C503.1 45.1,33.13 v45.5,33.53 45.1,33.93 C506.1
  pour Top (rank 3): -1,-0.97 101,-0.97 101,51.03 -1,51.03
+12V  (8 unrouted)
  Top 0.203: U101.23 3.79,56.25 2.6,57.43 C109.1 C111.1 | C112.1 C110.1 20.79,56.35 U102.23
  Top 0.406: 89,9.93 C303.+ 78.84,9.57 | 78.84,9.57 IC302.1 76.12,9.53 C302.1 | 78.84,9.57 78.84,20.19 77.46,21.57 IC301.1 76.12,21.53 C301.1
  Bottom 0.305: R105.2 R107.2 47.55,67.63 C108.1 53.2,67.63 Q104.C
+15V  (via drill 0.4)  (9 unrouted)
  Top 0.203: U301.16 70.94,37.81 70.41,37.81 70.19,37.6 70.19,36.82 70.41,36.6 73.99,36.6 74.71,35.88 75.67,35.88 76.82,37.03 D301.C
  Top 0.305: U204.7 50.63,59.67 v51.5,60.53 | U203.7 56.63,59.67 v57.5,60.53 | U201.7 44.63,59.67 v45.5,60.53 | U202.7 38.63,59.67 v39.5,60.53
  Top 0.406: U103.4 v11.37,62.03 | D301.C 85.22,37.03 C314.+
  Bottom 0.305: v51.5,60.53 51.4,60.43 C204.1 | v57.5,60.53 57.4,60.43 C203.1 | v45.5,60.53 45.4,60.43 C201.1 | v39.5,60.53 39.4,60.43 C202.1
  Bottom 0.406: v11.37,62.03 11.37,66.27 C113.1
-15V  (via drill 0.4)  (9 unrouted)
  Top 0.203: U301.9 70.94,30.25 70.41,30.25 70.19,30.47 70.19,31.25 70.41,31.46 73.99,31.46 74.71,32.19 75.67,32.19 76.82,31.03 D302.A
  Top 0.305: U204.4 48.09,61.94 v48.5,61.53 | U203.4 54.09,61.94 v54.5,61.53 | U201.4 42.09,61.94 v42.5,61.53 | U202.4 36.09,61.94 v36.5,61.53
  Top 0.406: U103.13 v11.37,75.03 | D302.A 85.22,31.03 C315.- 90,29.81
  Bottom 0.305: C208.1 48.5,62.93 v48.5,61.53 | v54.5,61.53 54.5,62.93 C207.1 | v42.5,61.53 42.5,62.93 C205.1 | v36.5,61.53 36.5,62.93 C206.1
  Bottom 0.406: v11.37,75.03 11.37,70.8 C115.1
BYP_G
  Bottom 0.305: R101.1 R104.1 R108.1 40.55,76.53 53.55,76.53 Q105.E 55.02,75.06 | 55.02,75.06 55.2,74.88 R112.2 58.6,74.88 | R115.1 R120.1 58.6,74.88 | R126.1 59.75,76.03 58.6,74.88 | Q104.E 55.02,70.71 55.02,75.06
BYP_I  (via drill 0.4)  (1 unrouted)
  Top 0.305: U503.7 45.87,37.67 v45.5,38.03 45.35,38.18 C509.1
  Bottom 0.305: v45.5,38.03 45.35,38.18 C509.1 | R103.1 C107.1
CLR_DAC_I  (via drill 0.4)
  Top 0.203: C507.1 12.35,40.53 11,40.53 v10.5,41.03 8.87,42.67 U101.6 | v14.5,43.03 21.55,43.03 21.76,42.82 23.82,42.82 25.2,44.21 25.2,44.77 U102.6
  Top 0.305: U501.7 13.87,37.67 v13.5,38.03 13.35,38.18 C507.1
  Bottom 0.203: v10.5,41.03 12.5,43.03 v14.5,43.03
  Bottom 0.305: v13.5,38.03 13.35,38.18 C507.1
CSENSE1_H  (via drill 0.4)
  Top 0.203: R111.2 40.5,84.03 40.75,83.78 40.75,66.96 42.7,65.01 42.7,64.3 U201.3 | U202.2 38.63,65 37.91,65.73 36.63,65.73 36.39,65.96 36.39,73.64 34.25,75.78 R110.1
  Top 0.406: R110.1 35.5,76.03 36,76.53 36,78.03
  other vias: 36,85.03 36,83.03 37,81.53 39,81.53 39,87.03 37,87.03 36,89.03 36,91.03 37,92.53 39,92.53
  pour Top: 33,77.03 40,77.03 40,101.03 33,101.03
  pour Bottom: 40.5,77.03 33,77.03 33,101.03 40.5,101.03
CSENSE1_L  (via drill 0.4)  (9 unrouted)
  Top 0.203: U202.3 36.7,64.3 36.7,65.08 35.99,65.8 35.99,73.47 34.92,74.54 32.5,74.54 31.25,75.79 R110.2
  Top 0.406: R110.2 30,76.03 29.5,76.53 29.5,78.03
  other vias: 22.5,90.53 24.5,90.53 24.5,88.53 24.5,86.53 24.5,84.53 24.5,82.53 22.5,82.53 22.5,84.53 22.5,86.53 22.5,88.53 31.5,84.03 29,84.03 27,87.03 27,89.03 27,85.03 29,90.03 31.5,90.03 27,91.03 27,93.03 27,95.03 29,96.03 31.5,96.03 27,83.03 27,81.03 27,79.03 29,78.03 31.5,78.03
  pour Top: 32.5,77.03 -0.5,77.03 -0.5,101.03 32.5,101.03
  pour Bottom: -1,77.03 32.5,77.03 32.5,101.03 -1,101.03
CSENSE2_H  (via drill 0.4)
  Top 0.203: R129.2 59.5,84.03 59.25,83.78 59.25,74.09 52.5,67.34 48.63,67.34 48.39,67.1 48.39,65.96 48.63,65.73 48.8,65.73 49.37,65.17 U204.3 | U203.2 56.63,62.67 56.2,62.23 54.94,62.23 54.76,62.41 54.76,65.02 53.99,65.8 53.99,67.27 54.46,67.74 61.14,67.74 65.75,72.36 R130.1
  Top 0.406: R130.1 64.5,76.03 64,76.53 64,78.03
  other vias: 61,87.03 63,87.03 64,89.03 64,91.03 63,92.53 61,92.53 64,85.03 64,83.03 63,81.53 61,81.53
  pour Top: 60,77.03 67,77.03 67,101.03 60,101.03
  pour Bottom: 67,77.03 59.5,77.03 59.5,101.03 67,101.03
CSENSE2_L  (via drill 0.4)  (9 unrouted)
  Top 0.203: U203.3 55.37,64.99 54.39,65.96 54.39,67.1 54.63,67.34 61.8,67.34 68.75,74.28 R130.2
  Top 0.406: R130.2 70,76.03 70.5,76.53 70.5,78.03
  other vias: 68.5,84.03 68.5,78.03 71,78.03 71,84.03 71,90.03 68.5,90.03 68.5,96.03 71,96.03 73,95.03 73,93.03 73,91.03 73,89.03 73,87.03 73,85.03 73,83.03 73,81.03 73,79.03 75.5,82.53 77.5,82.53 77.5,84.53 75.5,84.53 75.5,86.53 77.5,86.53 77.5,88.53 75.5,88.53 75.5,90.53 77.5,90.53
  pour Top: 67.5,77.03 67.5,101.03 80,101.03 80,77.03
  pour Bottom: 101,77.03 101,101.03 67.5,101.03 67.5,77.03
DAC_FAULT  (via drill 0.4)
  Top 0.305: U502.6 5.87,29.4 v5.5,29.03 5.35,28.88 R511.1
  Bottom 0.305: v5.5,29.03 5.35,28.88 R511.1
FAN_GND  (1 unrouted)
FLT_DAC_I  (via drill 0.4)
  Top 0.203: R102.2 2.5,39.53 3.45,40.48 Q505.B 3.95,40.48 5.05,41.59 U101.3 5.05,47.09 7,49.03 v18,49.03 | U102.3 v22.05,43.53
  Bottom 0.203: v18,49.03 18,47.59 v22.05,43.53
GATE1  (1 unrouted)
  Top 0.203: R106.2 8,83.08
GATE2  (1 unrouted)
  Top 0.203: R123.2 14,83.08
GND  (via drill 0.4)  (38 unrouted)
  Top 0.203: U101.4 U101.5 | U102.4 U102.5 | U102.11 32.22,43.82 v32.5,43.53 | U101.11 15.21,44.44 v15.92,43.74 | R132.1 R133.1
  Top 0.305: U503.2 U503.3 | U503.3 47.13,27.55 Q506.C Q503.C Q511.C | v47.5,33.53 47.13,33.17 U503.3 | U506.3 39.13,27.55 Q511.C | Q511.C Q508.C Q510.C 31.15,30.92 U505.3 | Q507.C Q509.C | Q509.C Q512.C Q504.C | Q509.C 23.15,30.92 U504.3 | Q504.C 15.15,30.92 U501.3 | U501.3 U501.2 | Q504.C Q501.C | v15.5,33.53 15.13,33.17 U501.3 | Q502.C Q505.C 5.85,36.15 U502.3 | U502.3 U502.2 | U502.3 5.87,33.9 v5.5,33.53 | C311.- v71.5,26.03 | C312.2 v54.5,29.53 | C308.- v54.5,32.53 | C307.1 v54.5,36.03 | C310.1 v54.5,38.53 | U301.2 v64.5,37.21 | U301.14 v69.5,35.94 | U301.11 v69.5,32.13 | PAD310.1 v85.5,52.03 84,50.53 C114.2 | v80,66.03 79.55,66.03 R214.1
  Top 0.406: U506.5 40.41,34.44 v39.5,33.53 39.13,33.17 U506.3 U506.2 | U505.5 32.41,34.44 v31.5,33.53 31.14,33.17 U505.3 U505.2 | U504.5 24.41,34.44 v23.5,33.53 23.14,33.17 U504.3 U504.2 | U502.5 4.59,32.63 v5.5,33.53 | U501.5 16.41,34.44 v15.5,33.53 | U503.5 48.41,34.44 v47.5,33.53 | C301.2 v68,21.53 | C304.2 v68,16.53 | C302.2 v68,9.53 | C305.2 v68,4.53
  other vias: 87,19.03 91,19.03
  pour Bottom (rank 4): -5,105.03 -5,-4.97 105,-4.97 105,105.03
LBQ11_G  (via drill 0.4)
  Top 0.305: Q101.4 34.17,95.36 v33.5,96.03
  Bottom 0.305: v33.5,96.03 32.26,94.79 32.26,76.34 37.56,71.03 R101.2
LBQ12_G  (via drill 0.4)
  Top 0.305: Q102.4 34.17,89.36 v33.5,90.03
  Bottom 0.305: v33.5,90.03 32.77,89.3 32.77,76.55 35.78,73.53 R104.2
LBQ13_G  (via drill 0.4)
  Top 0.305: Q106.4 34.17,83.39 v33.53,84.03
  Bottom 0.305: v33.53,84.03 33.27,83.78 33.27,76.76 34,76.03 R108.2
LBQ21_G  (via drill 0.4)
  Top 0.305: Q108.4 65.83,90.7 v66.5,90.03
  Bottom 0.305: v66.5,90.03 67.74,88.79 67.74,76.34 62.44,71.03 R115.2
LBQ22_G  (via drill 0.4)
  Top 0.305: Q109.4 65.83,84.7 v66.5,84.03
  Bottom 0.305: v66.5,84.03 67.23,83.3 67.23,76.55 64.22,73.53 R120.2
LBQ23_G  (via drill 0.4)
  Top 0.305: Q110.4 65.83,78.68 v66.47,78.03
  Bottom 0.305: v66.47,78.03 66.47,76.51 66,76.03 R126.2
LQ1_G
  Top 0.203: U103.16 7.55,75.94 | 7.55,75.94 R127.2 | 7.55,75.94 7.55,78.44 R132.2 7.95,78.83 R106.1
LQ2_G
  Top 0.203: U103.10 15.18,74.86 R128.2 R133.2 16.05,78.83 R123.1
MISO  (via drill 0.4)
  Top 0.305: U502.7 7.13,29.4 v7.5,29.03 7.65,28.88 C508.1
  Bottom 0.305: v7.5,29.03 7.65,28.88 C508.1
MISO_I  (via drill 0.4)
  Top 0.203: U208.6 73.36,48.67 73,49.03 70.86,49.03 70.16,49.74 68.7,49.74 67.51,48.54 67.51,46.04 67,45.53 65,45.53 64.36,46.17 U106.6 64.36,48.67 64,49.03 61.86,49.03 61.16,49.74 56.7,49.74 56,49.03 56,46.03 55.5,45.53 53,45.53 52.37,46.17 U207.6 52.37,48.67 52,49.03 46.86,49.03 46.16,49.74 44.84,49.74 44,48.89 44,46.03 43.5,45.53 41,45.53 40.37,46.17 U206.6 40.37,47.9 40.5,48.03 39.5,49.03 v32,49.03 | Q502.B 8.26,41.09 8.26,46.66 9.63,48.03 29,48.03 v29.5,48.53
  Bottom 0.203: v29.5,48.53 31.5,48.53 v32,49.03
MOSI_I  (via drill 0.4)
  Top 0.203: U208.5 70.9,47.43 70.5,47.03 68.5,47.03 67.92,46.45 67.92,45.87 67.17,45.13 63.91,45.13 63.09,45.94 U106.5 61.9,47.43 61.5,47.03 56.94,47.03 56.41,46.5 56.41,45.86 55.58,45.03 52,45.03 51.09,45.94 U207.5 46.9,47.43 46.5,47.03 44.94,47.03 44.41,46.5 44.41,45.86 43.58,45.03 40,45.03 39.09,45.94 U206.5 30.9,47.43 30.28,46.81 30.28,44.21 27.11,41.03 25.15,41.03 C522.1 22.24,40.94 15.39,40.94 12.68,43.66 U101.9
  Top 0.305: U504.6 23.14,37.67 v23.5,38.03 23.65,38.18 C522.1
  Bottom 0.305: v23.5,38.03 23.65,38.18 C522.1
N$1
  Top 0.305: MOV201.2 88,76.65 MOV202.1
N$2
  Top 0.305: MOV202.2 91.94,72.59 MOV203.1
N$3
  Top 0.203: C109.2 6.1,56.83 6.1,56.36 6.33,56.13 U101.21
N$4
  Top 0.203: C111.2 6.5,58.93 6.5,56.53 7.59,55.44 U101.20
N$5
  Bottom 0.305: R107.1 47.45,70.38 Q103.C 50.75,72.93 50.83,72.86 | Q104.B 50.83,72.86 | 50.83,72.86 53.05,75.08 Q105.B
N$6
  Top 0.203: C110.2 23.32,56.61 U102.21
N$7
  Top 0.203: C112.2 23.5,58.93 23.5,57.03 24.59,55.94 U102.20
N$8
  Bottom 0.305: Q103.B 48.98,75.06 48.8,74.88 | 48.8,74.88 R103.2 C107.2 | R105.1 45.65,72.03 47,72.03 48,73.03 48,74.08 48.8,74.88
N$9  (via drill 0.4)
  Top 0.203: R128.1 13.9,75.29 U103.11
  Top 0.406: U103.11 13.9,71.63 14.5,71.03 v17.5,71.03
  Bottom 0.406: v17.5,71.03 16.5,71.03 16,70.53 R122.2
N$10
  Top 0.203: U101.17 10.74,55.3 10.74,55.86 10.07,56.53 7.73,56.53 6.91,57.35 6.91,64.62 5.79,65.74 5.79,66.33 10.1,70.63 U103.14
N$11
  Top 0.203: U102.17 28.41,56.13 27.86,56.68 24.43,56.68 24.04,57.07 24.04,60.43 23.23,61.24 19.8,61.24 19,62.03 19,68.53 17.5,70.03 13.5,70.03 12.63,70.9 U103.12
N$12  (via drill 0.4)
  Top 0.203: R127.1 8.82,75.51 U103.15
  Top 0.406: U103.15 8.82,71.36 8.5,71.03 v6.5,71.03
  Bottom 0.406: v6.5,71.03 7.5,71.03 8,70.53 R121.2
N$13  (via drill 0.4)
  Top 0.203: 8.05,57.63 R117.2 8.07,57.61 8.07,60.11 | U103.1 7.55,60.63 8.07,60.11 | 8.07,60.11 R116.2
  Top 0.406: U103.1 7.55,65.48 7,66.03 v6.5,66.03
  Bottom 0.406: v6.5,66.03 7.5,66.03 8,66.53 R121.1
N$14
  Top 0.203: R113.2 14.15,56.53 10.85,56.53 R117.1 R116.1 8.82,61.06 U103.2
N$15
  Top 0.203: R119.1 R118.1 | R118.1 12.65,59.03 14.15,59.03 R114.2 | R118.1 13.9,62.29 U103.6
N$16  (via drill 0.4)
  Top 0.203: R119.2 14.99,59.18 15.72,59.18 16,59.46 16,61.03 15.18,61.86 | U103.7 15.18,61.86 | R118.2 15.18,61.86
  Top 0.406: U103.7 15.18,65.21 16,66.03 v17.5,66.03
  Bottom 0.406: R122.1 16,66.53 16.5,66.03 v17.5,66.03
N$17
  Top 0.305: U203.6 55.37,57.17 56,56.53 56.55,56.53 R210.1
N$18
  Top 0.305: U207.2 53.63,54.17 55,55.53 R210.2 55.5,55.53 56.5,54.53 57,54.53 57.5,54.03 C211.1
N$19
  Top 0.305: U204.6 49.37,56.45 R211.1
N$20
  Top 0.305: U207.3 52.37,54.17 51,55.53 R211.2 49.55,54.53 49,54.53 48.5,54.03 C212.1
N$21
  Top 0.305: U206.2 41.63,54.17 43,55.53 R208.2 45.5,53.48 C209.1
N$22
  Top 0.305: U206.3 40.37,54.17 39,55.53 R209.2 38.55,55.44 C210.1
N$23
  Top 0.305: U202.6 37.37,56.45 R209.1
N$24
  Top 0.305: U201.6 43.37,57.17 44,56.53 44.55,56.53 R208.1
N$25
  Top 0.305: R212.1 R213.2
N$26
  Top 0.305: R206.2 R212.2
N$27
  Top 0.305: R207.2 R206.1
N$28
  Top 0.305: R205.2 R207.1
N$29
  Top 0.305: U205.3 73.36,64.67 72.86,65.17 72.4,65.17 71.83,65.73 71.83,67.33 74.04,69.53 R213.1 R214.2
N$30
  Top 0.305: C218.1 78.5,55.48 | 78.5,55.48 R216.2 | U208.2 74.64,54.17 75,54.53 77.55,54.53 78.5,55.48
N$31
  Top 0.203: U205.6 73.36,56.67 73.64,56.39 75.14,56.39 76,55.53 R216.1
N$32
  Top 0.203: 58.95,29.59 C312.1
  Top 0.305: U301.8 62.34,29.53 C312.1
N$33
  Top 0.305: U301.7 61.17,30.86 59.5,32.53 C308.+
N$34
  Top 0.203: 58.95,38.48 C310.2
  Top 0.305: U301.1 62.34,38.53 C310.2
N$35
  Top 0.203: U301.15 75.02,37.21 D301.A 75.19,39.76 L302.2
N$36
  Top 0.305: MOV204.1 94,74.15 MOV203.2
N$37  (5 unrouted)
N$38  (via drill 0.4)
  Top 0.406: U302.6 U302.7 32.17,65.71 33,66.53 v35,66.53
  Bottom 0.406: v35,66.53 R306.1
N$39  (1 unrouted)
  Top 0.406: U302.2 U302.1
N$40  (via drill 0.4)
  Top 0.406: U302.11 U302.10 32.17,71.36 33,70.53 v35,70.53
  Bottom 0.406: v35,70.53 R307.1
N$41
  Top 0.203: U301.10 75.02,30.86 D302.C 75.46,30.76 L301.1
N$42  (1 unrouted)
N$43  (1 unrouted)
  Top 0.406: U302.16 U302.15
N$44  (1 unrouted)
N$45
  Top 0.203: U208.3 73.36,55.05 R217.2
N$47
  Top 0.305: Q512.E 21.05,28.48 20.59,28.94 U504.1 20.59,32.59 R518.1
N$49
  Top 0.305: R513.1 28.59,32.59 U505.1 28.59,28.94 29.05,28.48 Q507.E
N$62
  Top 0.305: R515.1 26.25,30.93 U504.4 24.41,29.13 25.05,28.48 Q509.E
N$63  (1 unrouted)
  Top 0.305: 33,28.53 32.41,29.13 U505.4 34.25,30.93 R516.1
N$64
  Top 0.305: Q508.E 37.05,28.48 36.59,28.94 U506.1 36.59,32.59 R514.1
N$65
  Top 0.305: Q511.E 41.05,28.48 40.41,29.13 U506.4 42.25,30.93 R517.1
N$66
  Top 0.305: Q502.E 8.4,37.83 U502.1 8.4,34.48 R502.1
N$67
  Top 0.203: U502.4 4.1,36.13 3.5,35.53 3.5,33.38 R505.1
  Top 0.305: Q505.E 4.59,37.64 U502.4
N$68
  Top 0.305: R503.1 44.59,32.59 U503.1 44.59,28.94 45.05,28.48 Q503.E
N$69
  Top 0.305: Q506.E 49.05,28.48 48.41,29.13 U503.4 50.25,30.93 R506.1
N$73  (via drill 0.4)
  Top 0.305: U503.6 47.13,37.67 v47.5,38.03 47.65,38.18 R512.1
  Bottom 0.305: v47.5,38.03 47.65,38.18 R512.1
N$76
  Top 0.305: R501.1 12.6,32.59 U501.1 12.6,28.94 13.05,28.48 Q501.E
N$77
  Top 0.305: R504.1 18.25,30.93 U501.4 16.41,29.13 17.05,28.48 Q504.E
N$79  (2 unrouted)
RG1_H4
  Top 0.305: U203.1 57.91,65.13 57.5,65.53 56.75,65.53 55.75,66.53 R203.2
RG1_H5
  Top 0.305: U204.1 51.91,65.13 51.5,65.53 50.75,65.53 49.75,66.53 R204.2
RG1_H6
  Top 0.305: U205.1 75.91,65.13 75.5,65.53 74.5,65.53 73.5,66.53 R215.2
RG1_L3
  Top 0.305: U201.1 45.91,65.13 45.5,65.53 44.75,65.53 43.75,66.53 R201.2
RG1_L4
  Top 0.305: U202.1 39.91,65.13 39.5,65.53 38.75,65.53 37.75,66.53 R202.2
RG2_H4
  Top 0.305: U203.8 57.91,59.69 58.56,60.34 58.56,65.72 57.75,66.53 R203.1
RG2_H5
  Top 0.305: U204.8 51.91,59.69 52.56,60.34 52.56,65.72 51.75,66.53 R204.1
RG2_H6
  Top 0.305: U205.8 75.91,59.94 76.56,60.59 76.56,65.97 76,66.53 R215.1
RG2_L3
  Top 0.305: U201.8 45.91,59.69 46.56,60.34 46.56,65.72 45.75,66.53 R201.1
RG2_L4
  Top 0.305: U202.8 39.91,59.69 40.56,60.34 40.56,65.72 39.75,66.53 R202.1
SCK_I  (via drill 0.4)  (2 unrouted)
  Top 0.203: U208.7 74.64,48.9 73.8,49.74 70.73,49.74 70.32,50.14 68.54,50.14 68.13,49.74 61.87,49.74 61.46,50.14 56.54,50.14 56.13,49.74 46.73,49.74 46.32,50.14 44.68,50.14 44.27,49.74 41,49.74 | U106.7 65.64,49.1 65,49.74 | U207.7 53.63,49.1 53,49.74 | U206.7 41.63,49.1 41,49.74 | C519.1 20.35,40.53 15.22,40.53 11.4,44.35 U101.8 11.4,46.94 12,47.53 28,47.53 | U102.8 28.41,47.13 28,47.53 | 28,47.53 29.5,47.53 31.7,49.74 41,49.74
  Top 0.305: U504.7 21.86,37.67 v21.5,38.03 21.35,38.18 C519.1
  Bottom 0.305: v21.5,38.03 21.35,38.18 C519.1
SDO_DAC1
  Top 0.203: U102.9 29.68,44.71 29,44.03 27.98,44.03 27.74,44.27 27.74,46.66 27.56,46.84 14.3,46.84 13.95,46.48 U101.10
SS_CH_I  (via drill 0.4)
  Top 0.203: C523.1 36.15,44.03 47,44.03 v49,46.03 | v49.5,50.53 54,50.53 54.91,51.44 U207.1
  Top 0.305: U505.6 31.14,37.67 v31.5,38.03 31.65,38.18 C523.1
  Bottom 0.203: v49,46.03 49,50.03 v49.5,50.53
  Bottom 0.305: v31.5,38.03 31.65,38.18 C523.1
SS_CL_I  (via drill 0.4)
  Top 0.203: C520.1 30.35,40.53 32.08,40.53 36.5,44.96 v36.5,46.53 | v37.5,50.53 42,50.53 42.91,51.44 U206.1
  Top 0.305: U505.7 29.86,37.67 v29.5,38.03 29.35,38.18 C520.1
  Bottom 0.203: v36.5,46.53 36.5,49.53 v37.5,50.53
  Bottom 0.305: v29.5,38.03 29.35,38.18 C520.1
SS_DAC_I  (via drill 0.4)
  Top 0.203: R510.1 14.15,41.03 v13.5,41.03 12,41.03 10.13,42.9 U101.7 | U102.7 27.14,43.67 25.5,42.03 v15.5,42.03
  Top 0.305: U501.6 15.13,37.67 v15.5,38.03 15.65,38.18 R510.1
  Bottom 0.203: v13.5,41.03 14.5,42.03 v15.5,42.03
  Bottom 0.305: v15.5,38.03 15.65,38.18 R510.1
SS_TEMP_I  (via drill 0.4)
  Top 0.203: C521.1 41.35,43.53 61,43.53 v62,44.53 | v62,51.03 62.5,50.53 66,50.53 66.91,51.44 U106.1
  Top 0.305: U506.7 37.87,37.67 v37.5,38.03 37.35,38.18 C521.1
  Bottom 0.203: v62,44.53 v62,51.03
  Bottom 0.305: v37.5,38.03 37.35,38.18 C521.1
SS_V_I  (via drill 0.4)
  Top 0.203: C524.1 43.15,43.03 70,43.03 v71,44.03 | v71,50.53 75,50.53 75.91,51.44 U208.1
  Top 0.305: U506.6 39.13,37.67 v39.5,38.03 39.65,38.18 C524.1
  Bottom 0.203: v71,44.03 v71,50.53
  Bottom 0.305: v39.5,38.03 39.65,38.18 C524.1
T1_OUT  (via drill 0.4)
  Top 0.305: R124.1 67.45,58.09 67,58.53 C118.+ 67.37,58.53 68.72,59.89 74.78,59.89 v75.46,60.57 | v80,60.53 82.5,58.03 PAD307.1
  Bottom 0.305: v80,60.53 79.96,60.57 78.61,60.57 78.31,60.27 77.69,60.27 77.39,60.57 v75.46,60.57
T2_OUT  (via drill 0.4)  (1 unrouted)
  Top 0.305: R125.1 60.45,58.38 C119.+ 63.6,61.53 v74,61.53 | v78,62.53 86,62.53 87.5,64.03
  Bottom 0.305: v74,61.53 77,61.53 v78,62.53
TEMP1
  Top 0.305: U106.2 65.64,54.17 66,54.53 68.55,54.53 R124.2 69.5,55.48 C120.1
TEMP2
  Top 0.305: C121.1 62.33,55.21 | 62.33,55.21 62.55,55.44 R125.2 | U106.3 64.36,54.17 63,55.53 62.67,55.21 62.33,55.21
UUT-  (via drill 0.4)  (9 unrouted)
  Top 0.203: R111.1 41.5,84.03 41.25,83.78 41.25,67.11 42.63,65.73 43.3,65.73 44.63,64.4 U201.2 | R129.1 58.5,84.03 58.75,83.78 58.75,74.16 52.33,67.74 48.46,67.74 47.99,67.27 47.99,65.8 48.76,65.02 48.76,62.41 48.94,62.23 50.2,62.23 50.63,62.67 U204.2
  other vias: 51,86.53 49,90.53 49,86.53 49,88.53 51,88.53 51,90.53 51,84.53 51,82.53 49,82.53 49,84.53 43,81.53 45,81.53 43,92.53 45,92.53 43,87.03 45,87.03 46,89.03 46,91.03 46,85.03 46,83.03 57,92.53 55,92.53 55,87.03 57,87.03 57,81.53 55,81.53 54,85.03 54,83.03 54,89.03 54,91.03
  pour Top: 58,77.03 42,77.03 42,101.03 58,101.03
  pour Bottom: 41,77.03 59,77.03 59,101.03 41,101.03
VREF  (1 unrouted)
  Top 0.203: U101.14 15.21,53.32 16,52.53 30.5,52.53 30.95,52.98 U102.15
  Top 0.406: U101.15 U101.14
VREF2
  Top 0.305: U301.6 63.91,32.13 64.5,31.53 C311.+
VSENSE+  (2 unrouted)
  Top 0.305: MOV201.1 86,84.53 R205.1
VSENSE-  (5 unrouted)
  Top 0.305: U205.2 74.64,64.68 73.64,65.68 72.61,65.68 72.34,65.94 72.34,67.12 72.61,67.39 76.5,67.39 77.64,66.25 77.64,64.14 77.91,63.87 79.09,63.87 83.25,68.03 96,68.03 98,70.03 98,88.03 97,89.03 | MOV204.2 92,84.53

### Text on the board
tDocu: Gate 1 | Gate 2 | Source 1 | UUT- | Source 2 | Voltage sense | Temp 2 | Temp 1 | +5V Out | Fan Power | +12V In